# Altium project miniBackplane_SFP.PrjPCB (part 1 of 2)
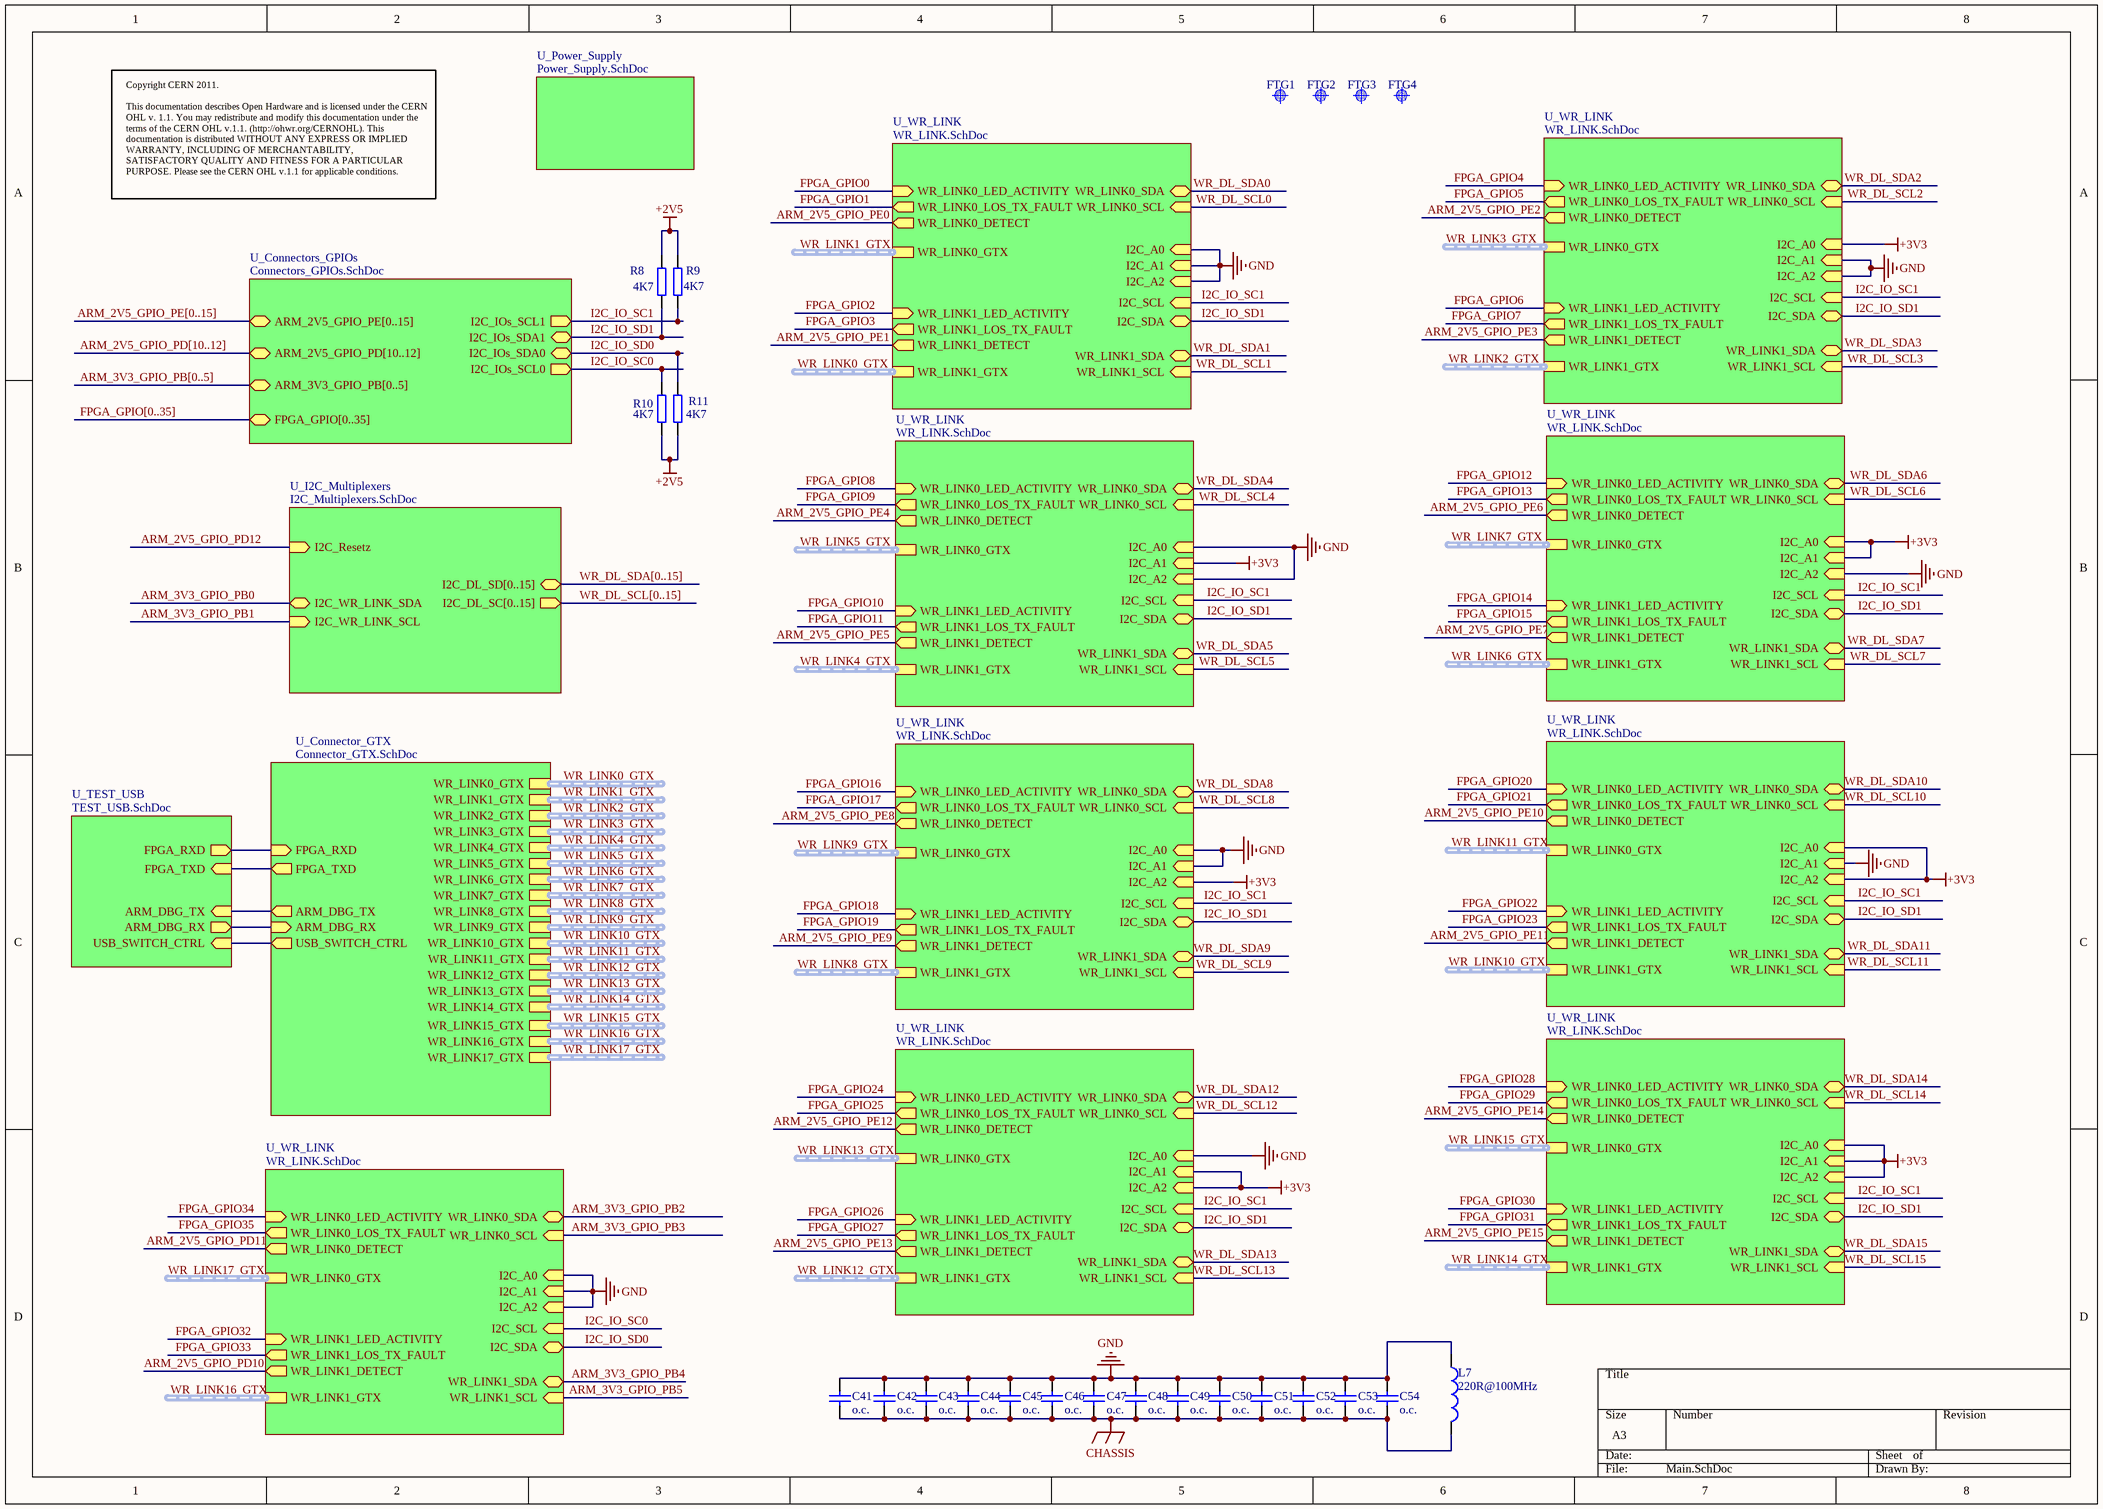
[diagram p0: Main.SchDoc]
7 sheets, 491 parts. Net scope: hierarchical (ports join the sheet entries above them; power ports are global).
Board file: miniBackplane.PcbDoc
Sheets:
  Main.SchDoc
    U_Connector_GTX = Connector_GTX.SchDoc
    U_I2C_Multiplexers = I2C_Multiplexers.SchDoc
    U_Power_Supply = Power_Supply.SchDoc
    U_TEST_USB = TEST_USB.SchDoc
    U_Connectors_GPIOs = Connectors_GPIOs.SchDoc
    U_WR_LINK = WR_LINK.SchDoc
    U_WR_LINK = WR_LINK.SchDoc
    U_WR_LINK = WR_LINK.SchDoc
    U_WR_LINK = WR_LINK.SchDoc
    U_WR_LINK = WR_LINK.SchDoc
    U_WR_LINK = WR_LINK.SchDoc
    U_WR_LINK = WR_LINK.SchDoc
    U_WR_LINK = WR_LINK.SchDoc
    U_WR_LINK = WR_LINK.SchDoc

## Sheet Main.SchDoc
size A3

### Parts
C41  o.c.  [CC1608-0603]
C42  o.c.  [CC1608-0603]
C43  o.c.  [CC1608-0603]
C44  o.c.  [CC1608-0603]
C45  o.c.  [CC1608-0603]
C46  o.c.  [CC1608-0603]
C47  o.c.  [CC1608-0603]
C48  o.c.  [CC1608-0603]
C49  o.c.  [CC1608-0603]
C50  o.c.  [CC1608-0603]
C51  o.c.  [CC1608-0603]
C52  o.c.  [CC1608-0603]
C53  o.c.  [CC1608-0603]
C54  o.c.  [CC1608-0603]
FTG1  Use only in PCB  [FIDUCIAL_TOP_S100-200]  (value not drawn)
FTG2  Use only in PCB  [FIDUCIAL_TOP_S100-200]  (value not drawn)
FTG3  Use only in PCB  [FIDUCIAL_TOP_S100-200]  (value not drawn)
FTG4  Use only in PCB  [FIDUCIAL_TOP_S100-200]  (value not drawn)
L7  Impedance: 220R@100MHz  [0603]  (hidden comment: 220R@100MHz Ferrite Bead)
R8  4K7  [0603]
R9  4K7  [0603]
R10  4K7  [0603]
R11  4K7  [0603]

### Sub-sheets
U_Connector_GTX = Connector_GTX.SchDoc: WR_LINK0_GTX (harness WR_LINK_GTX), WR_LINK1_GTX (harness WR_LINK_GTX), WR_LINK2_GTX (harness WR_LINK_GTX), WR_LINK3_GTX (harness WR_LINK_GTX), WR_LINK4_GTX (harness WR_LINK_GTX), WR_LINK5_GTX (harness WR_LINK_GTX), WR_LINK6_GTX (harness WR_LINK_GTX), WR_LINK7_GTX (harness WR_LINK_GTX), WR_LINK8_GTX (harness WR_LINK_GTX), WR_LINK9_GTX (harness WR_LINK_GTX), WR_LINK10_GTX (harness WR_LINK_GTX), WR_LINK11_GTX (harness WR_LINK_GTX), WR_LINK17_GTX (harness WR_LINK_GTX), WR_LINK16_GTX (harness WR_LINK_GTX), WR_LINK15_GTX (harness WR_LINK_GTX), WR_LINK14_GTX (harness WR_LINK_GTX), WR_LINK13_GTX (harness WR_LINK_GTX), WR_LINK12_GTX (harness WR_LINK_GTX), FPGA_RXD (in), FPGA_TXD (out), ARM_DBG_TX (out), ARM_DBG_RX (in), USB_SWITCH_CTRL (out)
U_Connectors_GPIOs = Connectors_GPIOs.SchDoc: ARM_2V5_GPIO_PE[0..15] (bidir), FPGA_GPIO[0..35] (bidir), ARM_2V5_GPIO_PD[10..12] (bidir), ARM_3V3_GPIO_PB[0..5] (bidir), I2C_IOs_SCL1 (out), I2C_IOs_SDA1 (bidir), I2C_IOs_SCL0 (out), I2C_IOs_SDA0 (bidir)
U_I2C_Multiplexers = I2C_Multiplexers.SchDoc: I2C_DL_SD[0..15] (bidir), I2C_DL_SC[0..15] (out), I2C_Resetz (in), I2C_WR_LINK_SDA (bidir), I2C_WR_LINK_SCL (in)
U_Power_Supply = Power_Supply.SchDoc: no entries
U_TEST_USB = TEST_USB.SchDoc: FPGA_RXD (out), FPGA_TXD (in), ARM_DBG_TX (in), ARM_DBG_RX (out), USB_SWITCH_CTRL (in)
U_WR_LINK = WR_LINK.SchDoc: WR_LINK0_GTX (harness WR_LINK_GTX), I2C_A0 (in), I2C_A1 (in), I2C_A2 (in), I2C_SDA (bidir), I2C_SCL (in), WR_LINK0_SDA (bidir), WR_LINK0_SCL (in), WR_LINK0_DETECT (out), WR_LINK0_LOS_TX_FAULT (out), WR_LINK0_LED_ACTIVITY (in), WR_LINK1_LED_ACTIVITY (in), WR_LINK1_GTX (harness WR_LINK_GTX), WR_LINK1_SDA (bidir), WR_LINK1_SCL (in), WR_LINK1_DETECT (out), WR_LINK1_LOS_TX_FAULT (out)
U_WR_LINK = WR_LINK.SchDoc: WR_LINK0_GTX (harness WR_LINK_GTX), I2C_A0 (in), I2C_A1 (in), I2C_A2 (in), I2C_SDA (bidir), I2C_SCL (in), WR_LINK0_SDA (bidir), WR_LINK0_SCL (in), WR_LINK0_DETECT (out), WR_LINK0_LOS_TX_FAULT (out), WR_LINK0_LED_ACTIVITY (in), WR_LINK1_LED_ACTIVITY (in), WR_LINK1_GTX (harness WR_LINK_GTX), WR_LINK1_SDA (bidir), WR_LINK1_SCL (in), WR_LINK1_DETECT (out), WR_LINK1_LOS_TX_FAULT (out)
U_WR_LINK = WR_LINK.SchDoc: WR_LINK0_GTX (harness WR_LINK_GTX), I2C_A0 (in), I2C_A1 (in), I2C_A2 (in), I2C_SDA (bidir), I2C_SCL (in), WR_LINK0_SDA (bidir), WR_LINK0_SCL (in), WR_LINK0_DETECT (out), WR_LINK0_LOS_TX_FAULT (out), WR_LINK0_LED_ACTIVITY (in), WR_LINK1_LED_ACTIVITY (in), WR_LINK1_GTX (harness WR_LINK_GTX), WR_LINK1_SDA (bidir), WR_LINK1_SCL (in), WR_LINK1_DETECT (out), WR_LINK1_LOS_TX_FAULT (out)
U_WR_LINK = WR_LINK.SchDoc: WR_LINK0_GTX (harness WR_LINK_GTX), I2C_A0 (in), I2C_A1 (in), I2C_A2 (in), I2C_SDA (bidir), I2C_SCL (in), WR_LINK0_SDA (bidir), WR_LINK0_SCL (in), WR_LINK0_DETECT (out), WR_LINK0_LOS_TX_FAULT (out), WR_LINK0_LED_ACTIVITY (in), WR_LINK1_LED_ACTIVITY (in), WR_LINK1_GTX (harness WR_LINK_GTX), WR_LINK1_SDA (bidir), WR_LINK1_SCL (in), WR_LINK1_DETECT (out), WR_LINK1_LOS_TX_FAULT (out)
U_WR_LINK = WR_LINK.SchDoc: WR_LINK0_GTX (harness WR_LINK_GTX), I2C_A0 (in), I2C_A1 (in), I2C_A2 (in), I2C_SDA (bidir), I2C_SCL (in), WR_LINK0_SDA (bidir), WR_LINK0_SCL (in), WR_LINK0_DETECT (out), WR_LINK0_LOS_TX_FAULT (out), WR_LINK0_LED_ACTIVITY (in), WR_LINK1_LED_ACTIVITY (in), WR_LINK1_GTX (harness WR_LINK_GTX), WR_LINK1_SDA (bidir), WR_LINK1_SCL (in), WR_LINK1_DETECT (out), WR_LINK1_LOS_TX_FAULT (out)
U_WR_LINK = WR_LINK.SchDoc: WR_LINK0_GTX (harness WR_LINK_GTX), I2C_A0 (in), I2C_A1 (in), I2C_A2 (in), I2C_SDA (bidir), I2C_SCL (in), WR_LINK0_SDA (bidir), WR_LINK0_SCL (in), WR_LINK0_DETECT (out), WR_LINK0_LOS_TX_FAULT (out), WR_LINK0_LED_ACTIVITY (in), WR_LINK1_LED_ACTIVITY (in), WR_LINK1_GTX (harness WR_LINK_GTX), WR_LINK1_SDA (bidir), WR_LINK1_SCL (in), WR_LINK1_DETECT (out), WR_LINK1_LOS_TX_FAULT (out)
U_WR_LINK = WR_LINK.SchDoc: WR_LINK0_GTX (harness WR_LINK_GTX), I2C_A0 (in), I2C_A1 (in), I2C_A2 (in), I2C_SDA (bidir), I2C_SCL (in), WR_LINK0_SDA (bidir), WR_LINK0_SCL (in), WR_LINK0_DETECT (out), WR_LINK0_LOS_TX_FAULT (out), WR_LINK0_LED_ACTIVITY (in), WR_LINK1_LED_ACTIVITY (in), WR_LINK1_GTX (harness WR_LINK_GTX), WR_LINK1_SDA (bidir), WR_LINK1_SCL (in), WR_LINK1_DETECT (out), WR_LINK1_LOS_TX_FAULT (out)
U_WR_LINK = WR_LINK.SchDoc: WR_LINK0_GTX (harness WR_LINK_GTX), I2C_A0 (in), I2C_A1 (in), I2C_A2 (in), I2C_SDA (bidir), I2C_SCL (in), WR_LINK0_SDA (bidir), WR_LINK0_SCL (in), WR_LINK0_DETECT (out), WR_LINK0_LOS_TX_FAULT (out), WR_LINK0_LED_ACTIVITY (in), WR_LINK1_LED_ACTIVITY (in), WR_LINK1_GTX (harness WR_LINK_GTX), WR_LINK1_SDA (bidir), WR_LINK1_SCL (in), WR_LINK1_DETECT (out), WR_LINK1_LOS_TX_FAULT (out)
U_WR_LINK = WR_LINK.SchDoc: WR_LINK0_GTX (harness WR_LINK_GTX), I2C_A0 (in), I2C_A1 (in), I2C_A2 (in), I2C_SDA (bidir), I2C_SCL (in), WR_LINK0_SDA (bidir), WR_LINK0_SCL (in), WR_LINK0_DETECT (out), WR_LINK0_LOS_TX_FAULT (out), WR_LINK0_LED_ACTIVITY (in), WR_LINK1_LED_ACTIVITY (in), WR_LINK1_GTX (harness WR_LINK_GTX), WR_LINK1_SDA (bidir), WR_LINK1_SCL (in), WR_LINK1_DETECT (out), WR_LINK1_LOS_TX_FAULT (out)

### Nets
+2V5: R8.2 R9.1 R10.2 R11.1
+3V3: sheet U_WR_LINK/I2C_A0, sheet U_WR_LINK/I2C_A1, sheet U_WR_LINK/I2C_A0, sheet U_WR_LINK/I2C_A1, sheet U_WR_LINK/I2C_A2, sheet U_WR_LINK/I2C_A0, sheet U_WR_LINK/I2C_A2, sheet U_WR_LINK/I2C_A1, sheet U_WR_LINK/I2C_A2, sheet U_WR_LINK/I2C_A0, sheet U_WR_LINK/I2C_A1, sheet U_WR_LINK/I2C_A2
CHASSIS: C41.1 C42.1 C43.1 C44.1 C45.1 C46.1 C47.1 C48.1 C49.1 C50.1 C51.1 C52.1 C53.1 C54.1 L7.2
GND: C41.2 C42.2 C43.2 C44.2 C45.2 C46.2 C47.2 C48.2 C49.2 C50.2 C51.2 C52.2 C53.2 C54.2 L7.1 ; sheet U_WR_LINK/I2C_A0, sheet U_WR_LINK/I2C_A1, sheet U_WR_LINK/I2C_A2, sheet U_WR_LINK/I2C_A1, sheet U_WR_LINK/I2C_A2, sheet U_WR_LINK/I2C_A0, sheet U_WR_LINK/I2C_A2, sheet U_WR_LINK/I2C_A2, sheet U_WR_LINK/I2C_A0, sheet U_WR_LINK/I2C_A1, sheet U_WR_LINK/I2C_A1, sheet U_WR_LINK/I2C_A0, sheet U_WR_LINK/I2C_A0, sheet U_WR_LINK/I2C_A1, sheet U_WR_LINK/I2C_A2
FPGA_RXD: sheet U_Connector_GTX/FPGA_RXD, sheet U_TEST_USB/FPGA_RXD
FPGA_TXD: sheet U_Connector_GTX/FPGA_TXD, sheet U_TEST_USB/FPGA_TXD
I2C_IO_SC0: R10.1 ; sheet U_Connectors_GPIOs/I2C_IOs_SCL0, sheet U_WR_LINK/I2C_SCL  [project net FPGA-GPIO37]
I2C_IO_SC1: R9.2 ; sheet U_Connectors_GPIOs/I2C_IOs_SCL1, sheet U_WR_LINK/I2C_SCL, sheet U_WR_LINK/I2C_SCL, sheet U_WR_LINK/I2C_SCL, sheet U_WR_LINK/I2C_SCL, sheet U_WR_LINK/I2C_SCL, sheet U_WR_LINK/I2C_SCL, sheet U_WR_LINK/I2C_SCL, sheet U_WR_LINK/I2C_SCL  [project net FPGA-GPIO39]
I2C_IO_SD0: R11.2 ; sheet U_Connectors_GPIOs/I2C_IOs_SDA0, sheet U_WR_LINK/I2C_SDA  [project net FPGA-GPIO36]
I2C_IO_SD1: R8.1 ; sheet U_Connectors_GPIOs/I2C_IOs_SDA1, sheet U_WR_LINK/I2C_SDA, sheet U_WR_LINK/I2C_SDA, sheet U_WR_LINK/I2C_SDA, sheet U_WR_LINK/I2C_SDA, sheet U_WR_LINK/I2C_SDA, sheet U_WR_LINK/I2C_SDA, sheet U_WR_LINK/I2C_SDA, sheet U_WR_LINK/I2C_SDA  [project net FPGA-GPIO38]
NetIC8_4: sheet U_Connector_GTX/USB_SWITCH_CTRL, sheet U_TEST_USB/USB_SWITCH_CTRL
NetIC8_5: sheet U_Connector_GTX/ARM_DBG_RX, sheet U_TEST_USB/ARM_DBG_RX
NetIC8_7: sheet U_Connector_GTX/ARM_DBG_TX, sheet U_TEST_USB/ARM_DBG_TX

### Buses and harness runs
bus ARM_2V5_GPIO_PD[10..12] = sheet U_Connectors_GPIOs/ARM_2V5_GPIO_PD[10..12]
bus ARM_2V5_GPIO_PE[0..15] = sheet U_Connectors_GPIOs/ARM_2V5_GPIO_PE[0..15]
bus ARM_3V3_GPIO_PB[0..5] = sheet U_Connectors_GPIOs/ARM_3V3_GPIO_PB[0..5]
bus FPGA_GPIO[0..35] = sheet U_Connectors_GPIOs/FPGA_GPIO[0..35]
bus WR_DL_SCL[0..15] = sheet U_I2C_Multiplexers/I2C_DL_SC[0..15]
bus WR_DL_SDA[0..15] = sheet U_I2C_Multiplexers/I2C_DL_SD[0..15]
harness WR_LINK0_GTX = sheet U_Connector_GTX/WR_LINK0_GTX
harness WR_LINK0_GTX = sheet U_WR_LINK/WR_LINK1_GTX
harness WR_LINK1_GTX = sheet U_Connector_GTX/WR_LINK1_GTX
harness WR_LINK1_GTX = sheet U_WR_LINK/WR_LINK0_GTX
harness WR_LINK2_GTX = sheet U_Connector_GTX/WR_LINK2_GTX
harness WR_LINK2_GTX = sheet U_WR_LINK/WR_LINK1_GTX
harness WR_LINK3_GTX = sheet U_Connector_GTX/WR_LINK3_GTX
harness WR_LINK3_GTX = sheet U_WR_LINK/WR_LINK0_GTX
harness WR_LINK4_GTX = sheet U_Connector_GTX/WR_LINK4_GTX
harness WR_LINK4_GTX = sheet U_WR_LINK/WR_LINK1_GTX
harness WR_LINK5_GTX = sheet U_Connector_GTX/WR_LINK5_GTX
harness WR_LINK5_GTX = sheet U_WR_LINK/WR_LINK0_GTX
harness WR_LINK6_GTX = sheet U_Connector_GTX/WR_LINK6_GTX
harness WR_LINK6_GTX = sheet U_WR_LINK/WR_LINK1_GTX
harness WR_LINK7_GTX = sheet U_Connector_GTX/WR_LINK7_GTX
harness WR_LINK7_GTX = sheet U_WR_LINK/WR_LINK0_GTX
harness WR_LINK8_GTX = sheet U_Connector_GTX/WR_LINK8_GTX
harness WR_LINK8_GTX = sheet U_WR_LINK/WR_LINK1_GTX
harness WR_LINK9_GTX = sheet U_Connector_GTX/WR_LINK9_GTX
harness WR_LINK9_GTX = sheet U_WR_LINK/WR_LINK0_GTX
harness WR_LINK10_GTX = sheet U_Connector_GTX/WR_LINK10_GTX
harness WR_LINK10_GTX = sheet U_WR_LINK/WR_LINK1_GTX
harness WR_LINK11_GTX = sheet U_Connector_GTX/WR_LINK11_GTX
harness WR_LINK11_GTX = sheet U_WR_LINK/WR_LINK0_GTX
harness WR_LINK12_GTX = sheet U_Connector_GTX/WR_LINK12_GTX
harness WR_LINK12_GTX = sheet U_WR_LINK/WR_LINK1_GTX
harness WR_LINK13_GTX = sheet U_Connector_GTX/WR_LINK13_GTX
harness WR_LINK13_GTX = sheet U_WR_LINK/WR_LINK0_GTX
harness WR_LINK14_GTX = sheet U_Connector_GTX/WR_LINK14_GTX
harness WR_LINK14_GTX = sheet U_WR_LINK/WR_LINK1_GTX
harness WR_LINK15_GTX = sheet U_Connector_GTX/WR_LINK15_GTX
harness WR_LINK15_GTX = sheet U_WR_LINK/WR_LINK0_GTX
harness WR_LINK16_GTX = sheet U_Connector_GTX/WR_LINK16_GTX
harness WR_LINK16_GTX = sheet U_WR_LINK/WR_LINK1_GTX
harness WR_LINK17_GTX = sheet U_Connector_GTX/WR_LINK17_GTX
harness WR_LINK17_GTX = sheet U_WR_LINK/WR_LINK0_GTX

### Notes on the sheet
- Copyright CERN 2011.
  This documentation describes Open Hardware and is licensed under the CERN OHL v. 1.1. You may redistribute and modify this documentation under the terms of the CERN OHL v.1.1. (http://ohwr.org/CERNOHL). This documentation is distributed WITHOUT ANY EXPRESS OR IMPLIED WARRANTY, INCLUDING OF MERCHANTABILITY, SATISFACTORY QUALITY AND FITNESS FOR A PARTICULAR PURPOSE. Please see the CERN OHL v.1.1 for applicable conditions.

### Library data of the parts
C41-C54 = CC0603_O.C.: Capacitor; Manufacturer1: Phycomp; TC: X7R; Tolerance: ±10%; Voltage: 16V; Published: 8-Jun-2000; LatestRevisionDate: 17-Jul-2002; LatestRevisionNote: Re-released for DXP Platform.; PackageReference: RAD-0.3; Publisher: Altium Limited; Manufacturer1 PN: *; Distributor1: Digikey; Distributor1 PN: *; Case: 0603; Value: o.c.
FTG1-FTG4 = Fiducial Target: Part Number: FIDUCIAL_TARGET_S100-200; Part Description: Scare Fiducial Target, Top Layer, 1.0mm, Top Sloder 2.0mm, Keepout =2.0mm; Mounted: No; Table: Pads; Component Kind: Standard (No BOM); Component Type: Standard (No BOM); Pin Count: 1; Family: Fiducial; Socket: No; SMD: Yes; Status: None; ComponentHeight: 0mm; Author: CERN DEM JLC; CreateDate: 2/9/2010; LatestRevisionDate: 2/9/2010; PackageDescription: Scare Fiducial Target, Top Layer, 1.0mm, Top Sloder 2.0mm, Keepout =2.0mm
L7 = L_FERRITE_BEAD: ferrite bead; Manufacturer1: Murata; Manufacturer1 PN: BLM18KG221SN1D; Current Rating: 2.2A; DCR: 50mOhm; Case: 0603; Distributor1: Digikey; Distributor1 PN: 490-5255-1-ND
R8-R11 = R0603_4.7K_±1%_0.1W_100PPM: SMD Resistor; Manufacturer1: Panasonic; Manufacturer1 PN: ERJ-3EKF4701V; TCR: 100ppm; Power Rating: 0.1W; Tolerance: ±1%; Case: 0603; Distributor1: DigiKey; Distributor1 PN: P4.70KHCT-ND; Value: 4K7

## Sheet Connector_GTX.SchDoc
size A3
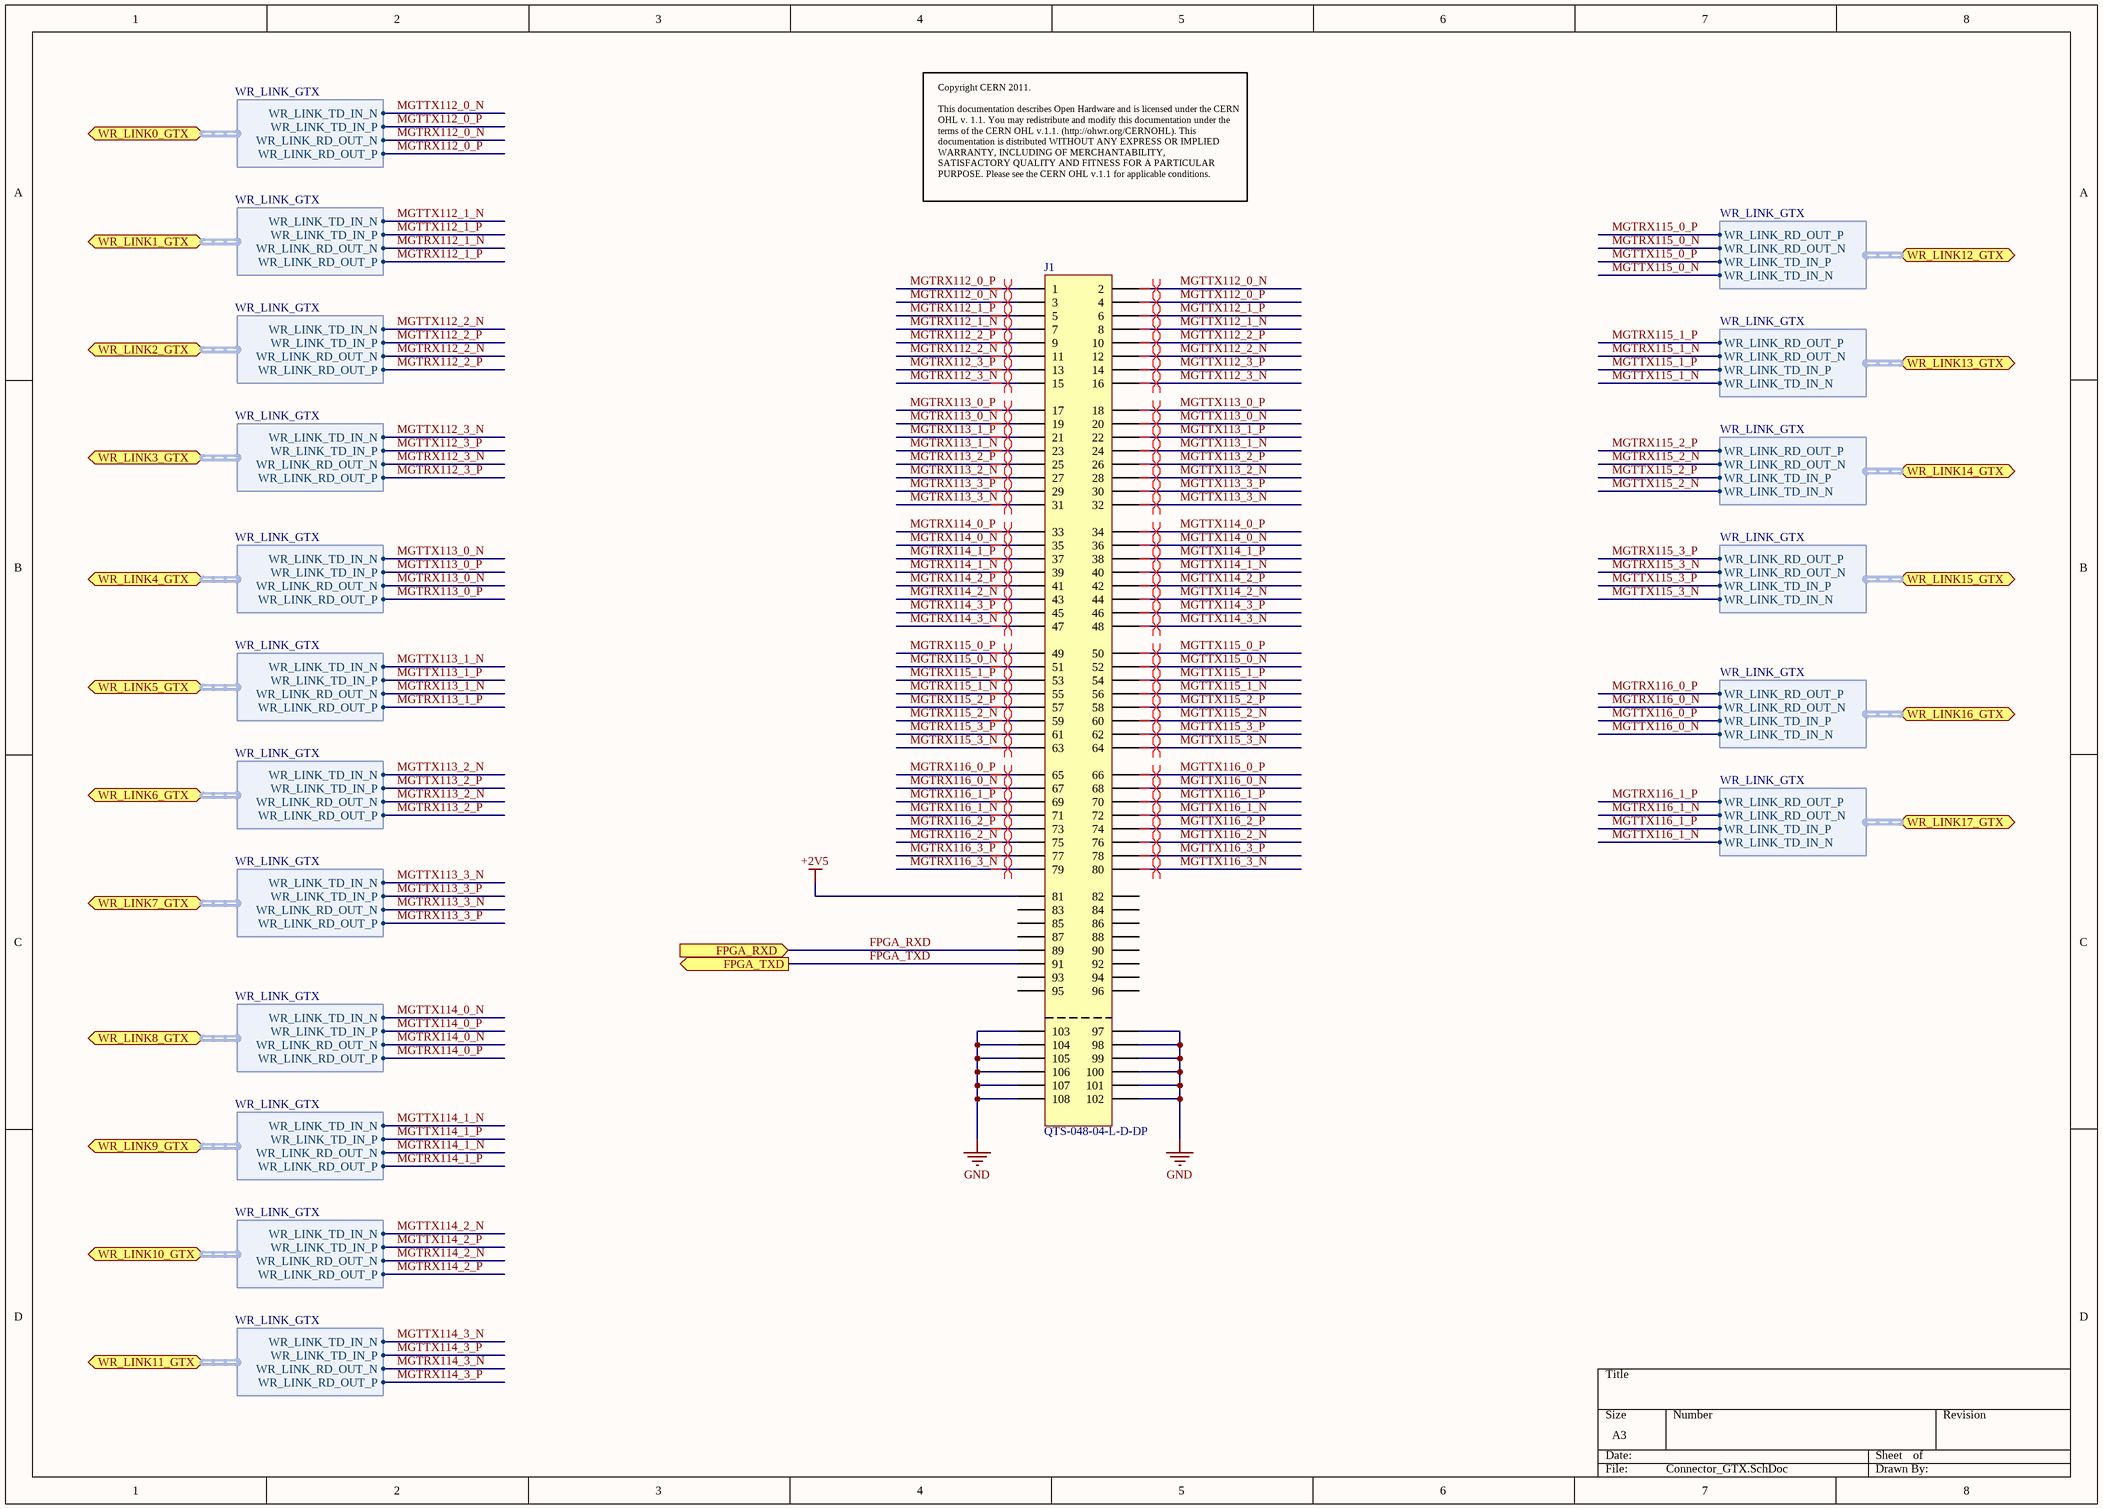
[diagram p1: Connector_GTX.SchDoc]

### Parts
J1  QTS-048-04-L-D-DP  [QTS-048-XX-X-D-DP-A]

### Ports
FPGA_RXD (in), FPGA_TXD (out), WR_LINK0_GTX (harness WR_LINK_GTX), WR_LINK1_GTX (harness WR_LINK_GTX), WR_LINK2_GTX (harness WR_LINK_GTX), WR_LINK3_GTX (harness WR_LINK_GTX), WR_LINK4_GTX (harness WR_LINK_GTX), WR_LINK5_GTX (harness WR_LINK_GTX), WR_LINK6_GTX (harness WR_LINK_GTX), WR_LINK7_GTX (harness WR_LINK_GTX), WR_LINK8_GTX (harness WR_LINK_GTX), WR_LINK9_GTX (harness WR_LINK_GTX), WR_LINK10_GTX (harness WR_LINK_GTX), WR_LINK11_GTX (harness WR_LINK_GTX), WR_LINK12_GTX (harness WR_LINK_GTX), WR_LINK13_GTX (harness WR_LINK_GTX), WR_LINK14_GTX (harness WR_LINK_GTX), WR_LINK15_GTX (harness WR_LINK_GTX), WR_LINK16_GTX (harness WR_LINK_GTX), WR_LINK17_GTX (harness WR_LINK_GTX)

### Harnesses
WR_LINK_GTX: WR_LINK_TD_IN_N, WR_LINK_TD_IN_P, WR_LINK_RD_OUT_N, WR_LINK_RD_OUT_P

### Nets
+2V5: J1.81
GND: J1.97 J1.98 J1.99 J1.100 J1.101 J1.102 J1.103 J1.104 J1.105 J1.106 J1.107 J1.108
FPGA_RXD: J1.89 ; port FPGA_RXD
FPGA_TXD: J1.91 ; port FPGA_TXD
MGTRX112_0_N: J1.3 ; port WR_LINK0_GTX.WR_LINK_RD_OUT_N
MGTRX112_0_P: J1.1 ; port WR_LINK0_GTX.WR_LINK_RD_OUT_P
MGTRX112_1_N: J1.7 ; port WR_LINK1_GTX.WR_LINK_RD_OUT_N
MGTRX112_1_P: J1.5 ; port WR_LINK1_GTX.WR_LINK_RD_OUT_P
MGTRX112_2_N: J1.11 ; port WR_LINK2_GTX.WR_LINK_RD_OUT_N
MGTRX112_2_P: J1.9 ; port WR_LINK2_GTX.WR_LINK_RD_OUT_P
MGTRX112_3_N: J1.15 ; port WR_LINK3_GTX.WR_LINK_RD_OUT_N
MGTRX112_3_P: J1.13 ; port WR_LINK3_GTX.WR_LINK_RD_OUT_P
MGTRX113_0_N: J1.19 ; port WR_LINK4_GTX.WR_LINK_RD_OUT_N
MGTRX113_0_P: J1.17 ; port WR_LINK4_GTX.WR_LINK_RD_OUT_P
MGTRX113_1_N: J1.23 ; port WR_LINK5_GTX.WR_LINK_RD_OUT_N
MGTRX113_1_P: J1.21 ; port WR_LINK5_GTX.WR_LINK_RD_OUT_P
MGTRX113_2_N: J1.27 ; port WR_LINK6_GTX.WR_LINK_RD_OUT_N
MGTRX113_2_P: J1.25 ; port WR_LINK6_GTX.WR_LINK_RD_OUT_P
MGTRX113_3_N: J1.31 ; port WR_LINK7_GTX.WR_LINK_RD_OUT_N
MGTRX113_3_P: J1.29 ; port WR_LINK7_GTX.WR_LINK_RD_OUT_P
MGTRX114_0_N: J1.35 ; port WR_LINK8_GTX.WR_LINK_RD_OUT_N
MGTRX114_0_P: J1.33 ; port WR_LINK8_GTX.WR_LINK_RD_OUT_P
MGTRX114_1_N: J1.39 ; port WR_LINK9_GTX.WR_LINK_RD_OUT_N
MGTRX114_1_P: J1.37 ; port WR_LINK9_GTX.WR_LINK_RD_OUT_P
MGTRX114_2_N: J1.43 ; port WR_LINK10_GTX.WR_LINK_RD_OUT_N
MGTRX114_2_P: J1.41 ; port WR_LINK10_GTX.WR_LINK_RD_OUT_P
MGTRX114_3_N: J1.47 ; port WR_LINK11_GTX.WR_LINK_RD_OUT_N
MGTRX114_3_P: J1.45 ; port WR_LINK11_GTX.WR_LINK_RD_OUT_P
MGTRX115_0_N: J1.51 ; port WR_LINK12_GTX.WR_LINK_RD_OUT_N
MGTRX115_0_P: J1.49 ; port WR_LINK12_GTX.WR_LINK_RD_OUT_P
MGTRX115_1_N: J1.55 ; port WR_LINK13_GTX.WR_LINK_RD_OUT_N
MGTRX115_1_P: J1.53 ; port WR_LINK13_GTX.WR_LINK_RD_OUT_P
MGTRX115_2_N: J1.59 ; port WR_LINK14_GTX.WR_LINK_RD_OUT_N
MGTRX115_2_P: J1.57 ; port WR_LINK14_GTX.WR_LINK_RD_OUT_P
MGTRX115_3_N: J1.63 ; port WR_LINK15_GTX.WR_LINK_RD_OUT_N
MGTRX115_3_P: J1.61 ; port WR_LINK15_GTX.WR_LINK_RD_OUT_P
MGTRX116_0_N: J1.67 ; port WR_LINK16_GTX.WR_LINK_RD_OUT_N
MGTRX116_0_P: J1.65 ; port WR_LINK16_GTX.WR_LINK_RD_OUT_P
MGTRX116_1_N: J1.71 ; port WR_LINK17_GTX.WR_LINK_RD_OUT_N
MGTRX116_1_P: J1.69 ; port WR_LINK17_GTX.WR_LINK_RD_OUT_P
MGTRX116_2_N: J1.75
MGTRX116_2_P: J1.73
MGTRX116_3_N: J1.79
MGTRX116_3_P: J1.77
MGTTX112_0_N: J1.2 ; port WR_LINK0_GTX.WR_LINK_TD_IN_N
MGTTX112_0_P: J1.4 ; port WR_LINK0_GTX.WR_LINK_TD_IN_P
MGTTX112_1_N: J1.8 ; port WR_LINK1_GTX.WR_LINK_TD_IN_N
MGTTX112_1_P: J1.6 ; port WR_LINK1_GTX.WR_LINK_TD_IN_P
MGTTX112_2_N: J1.12 ; port WR_LINK2_GTX.WR_LINK_TD_IN_N
MGTTX112_2_P: J1.10 ; port WR_LINK2_GTX.WR_LINK_TD_IN_P
MGTTX112_3_N: J1.16 ; port WR_LINK3_GTX.WR_LINK_TD_IN_N
MGTTX112_3_P: J1.14 ; port WR_LINK3_GTX.WR_LINK_TD_IN_P
MGTTX113_0_N: J1.20 ; port WR_LINK4_GTX.WR_LINK_TD_IN_N
MGTTX113_0_P: J1.18 ; port WR_LINK4_GTX.WR_LINK_TD_IN_P
MGTTX113_1_N: J1.24 ; port WR_LINK5_GTX.WR_LINK_TD_IN_N
MGTTX113_1_P: J1.22 ; port WR_LINK5_GTX.WR_LINK_TD_IN_P
MGTTX113_2_N: J1.28 ; port WR_LINK6_GTX.WR_LINK_TD_IN_N
MGTTX113_2_P: J1.26 ; port WR_LINK6_GTX.WR_LINK_TD_IN_P
MGTTX113_3_N: J1.32 ; port WR_LINK7_GTX.WR_LINK_TD_IN_N
MGTTX113_3_P: J1.30 ; port WR_LINK7_GTX.WR_LINK_TD_IN_P
MGTTX114_0_N: J1.36 ; port WR_LINK8_GTX.WR_LINK_TD_IN_N
MGTTX114_0_P: J1.34 ; port WR_LINK8_GTX.WR_LINK_TD_IN_P
MGTTX114_1_N: J1.40 ; port WR_LINK9_GTX.WR_LINK_TD_IN_N
MGTTX114_1_P: J1.38 ; port WR_LINK9_GTX.WR_LINK_TD_IN_P
MGTTX114_2_N: J1.44 ; port WR_LINK10_GTX.WR_LINK_TD_IN_N
MGTTX114_2_P: J1.42 ; port WR_LINK10_GTX.WR_LINK_TD_IN_P
MGTTX114_3_N: J1.48 ; port WR_LINK11_GTX.WR_LINK_TD_IN_N
MGTTX114_3_P: J1.46 ; port WR_LINK11_GTX.WR_LINK_TD_IN_P
MGTTX115_0_N: J1.52 ; port WR_LINK12_GTX.WR_LINK_TD_IN_N
MGTTX115_0_P: J1.50 ; port WR_LINK12_GTX.WR_LINK_TD_IN_P
MGTTX115_1_N: J1.56 ; port WR_LINK13_GTX.WR_LINK_TD_IN_N
MGTTX115_1_P: J1.54 ; port WR_LINK13_GTX.WR_LINK_TD_IN_P
MGTTX115_2_N: J1.60 ; port WR_LINK14_GTX.WR_LINK_TD_IN_N
MGTTX115_2_P: J1.58 ; port WR_LINK14_GTX.WR_LINK_TD_IN_P
MGTTX115_3_N: J1.64 ; port WR_LINK15_GTX.WR_LINK_TD_IN_N
MGTTX115_3_P: J1.62 ; port WR_LINK15_GTX.WR_LINK_TD_IN_P
MGTTX116_0_N: J1.68 ; port WR_LINK16_GTX.WR_LINK_TD_IN_N
MGTTX116_0_P: J1.66 ; port WR_LINK16_GTX.WR_LINK_TD_IN_P
MGTTX116_1_N: J1.72 ; port WR_LINK17_GTX.WR_LINK_TD_IN_N
MGTTX116_1_P: J1.70 ; port WR_LINK17_GTX.WR_LINK_TD_IN_P
MGTTX116_2_N: J1.76
MGTTX116_2_P: J1.74
MGTTX116_3_N: J1.80
MGTTX116_3_P: J1.78

Not connected (* = marked no-connect by the designer): J1 82 83 84 85 86 87 88 90 92 93 94 95 96

### Layout directives
differential pair: MGTRX112_0_N, MGTRX112_0_P, MGTRX112_1_N, MGTRX112_1_P, MGTRX112_2_N, MGTRX112_2_P, MGTRX112_3_N, MGTRX112_3_P, MGTRX113_0_N, MGTRX113_0_P, MGTRX113_1_N, MGTRX113_1_P, MGTRX113_2_N, MGTRX113_2_P, MGTRX113_3_N, MGTRX113_3_P, MGTRX114_0_N, MGTRX114_0_P, MGTRX114_1_N, MGTRX114_1_P, MGTRX114_2_N, MGTRX114_2_P, MGTRX114_3_N, MGTRX114_3_P, MGTRX115_0_N, MGTRX115_0_P, MGTRX115_1_N, MGTRX115_1_P, MGTRX115_2_N, MGTRX115_2_P, MGTRX115_3_N, MGTRX115_3_P, MGTRX116_0_N, MGTRX116_0_P, MGTRX116_1_N, MGTRX116_1_P, MGTRX116_2_N, MGTRX116_2_P, MGTRX116_3_N, MGTRX116_3_P, MGTTX112_0_N, MGTTX112_0_P, MGTTX112_1_N, MGTTX112_1_P, MGTTX112_2_N, MGTTX112_2_P, MGTTX112_3_N, MGTTX112_3_P, MGTTX113_0_N, MGTTX113_0_P, MGTTX113_1_N, MGTTX113_1_P, MGTTX113_2_N, MGTTX113_2_P, MGTTX113_3_N, MGTTX113_3_P, MGTTX114_0_N, MGTTX114_0_P, MGTTX114_1_N, MGTTX114_1_P, MGTTX114_2_N, MGTTX114_2_P, MGTTX114_3_N, MGTTX114_3_P, MGTTX115_0_N, MGTTX115_0_P, MGTTX115_1_N, MGTTX115_1_P, MGTTX115_2_N, MGTTX115_2_P, MGTTX115_3_N, MGTTX115_3_P, MGTTX116_0_N, MGTTX116_0_P, MGTTX116_1_N, MGTTX116_1_P, MGTTX116_2_N, MGTTX116_2_P, MGTTX116_3_N, MGTTX116_3_P

### Notes on the sheet
- Copyright CERN 2011.
  This documentation describes Open Hardware and is licensed under the CERN OHL v. 1.1. You may redistribute and modify this documentation under the terms of the CERN OHL v.1.1. (http://ohwr.org/CERNOHL). This documentation is distributed WITHOUT ANY EXPRESS OR IMPLIED WARRANTY, INCLUDING OF MERCHANTABILITY, SATISFACTORY QUALITY AND FITNESS FOR A PARTICULAR PURPOSE. Please see the CERN OHL v.1.1 for applicable conditions.

### Library data of the parts
J1 = QTS-048-01-L-D-DP: High Speed Ground Plane Header; Manufacturer1: Samtec; Manufacturer1 PN: QTS-048-04-L-D-DP

## Sheet I2C_Multiplexers.SchDoc
size A4 portrait
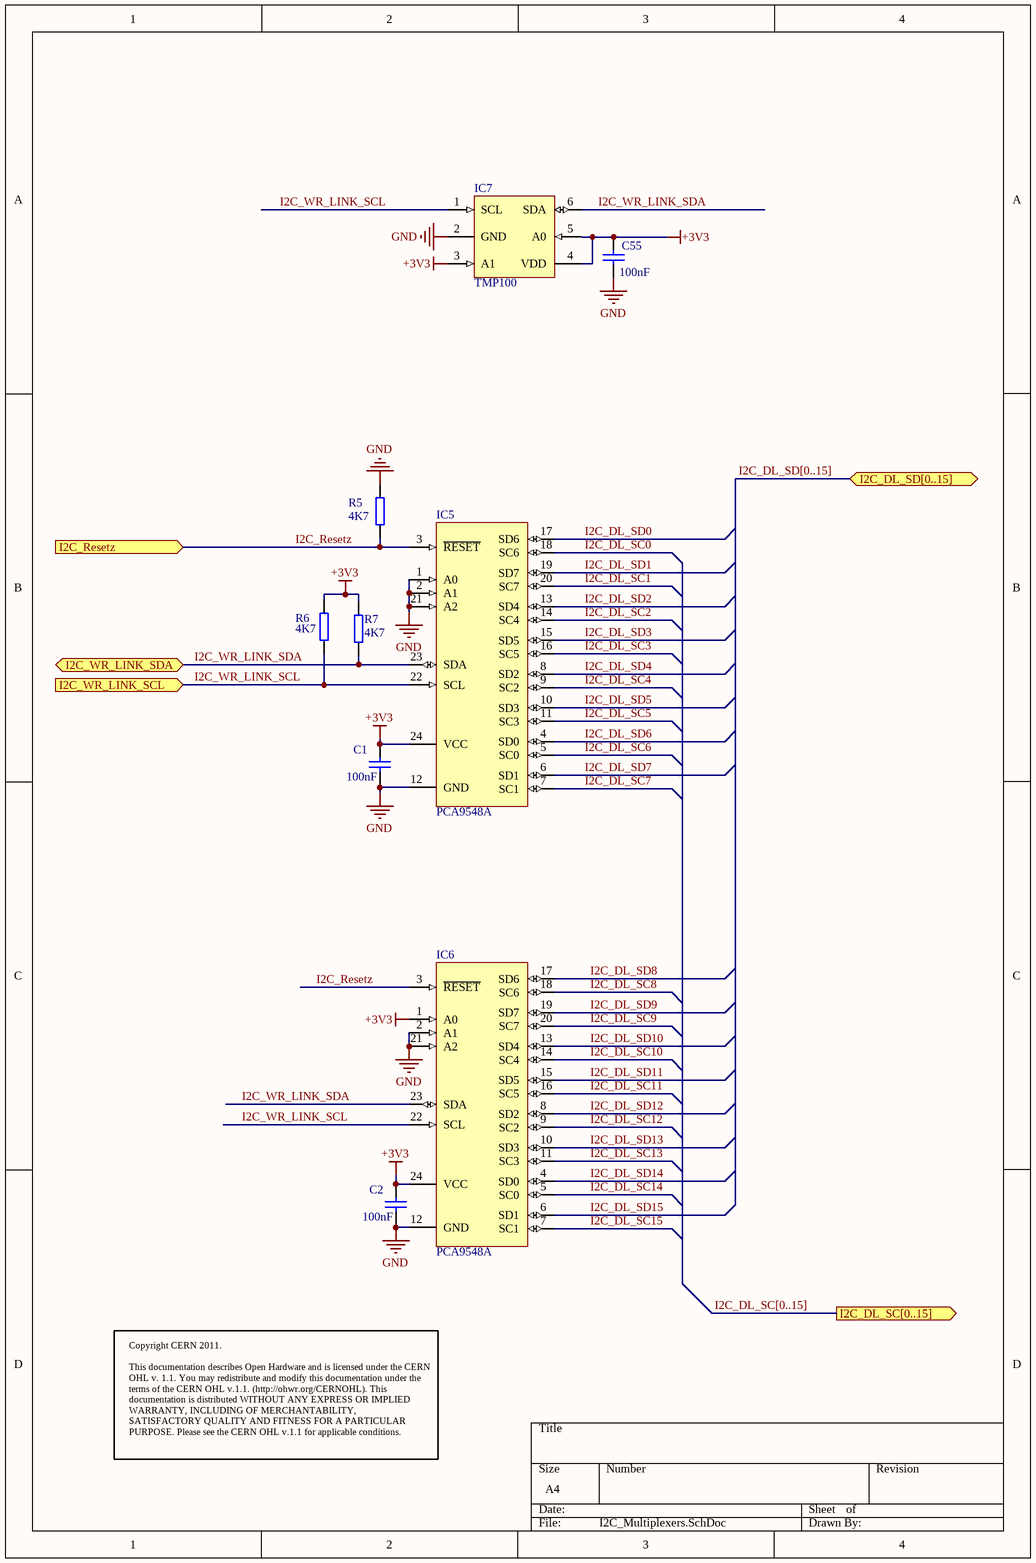
[diagram p2: I2C_Multiplexers.SchDoc]

### Parts
C1  100nF  [CC1608-0603]
C2  100nF  [CC1608-0603]
C55  100nF  [CC1608-0603]
IC5  PCA9548A  [SOP65P640X120-24N]
IC6  PCA9548A  [SOP65P640X120-24N]
IC7  TMP100  [SOT23A-6L]
R5  4K7  [0603]
R6  4K7  [0603]
R7  4K7  [0603]

### Ports
I2C_DL_SC[0..15] (out), I2C_DL_SD[0..15] (bidir), I2C_Resetz (in), I2C_WR_LINK_SCL (in), I2C_WR_LINK_SDA (bidir)

### Nets
+3V3: C1.2 C2.2 C55.2 IC5.24(VCC) IC6.1(A0) IC6.24(VCC) IC7.3(A1) IC7.4(VDD) IC7.5(A0) R6.1 R7.1
GND: C1.1 C2.1 C55.1 IC5.1(A0) IC5.2(A1) IC5.12(GND) IC5.21(A2) IC6.2(A1) IC6.12(GND) IC6.21(A2) IC7.2(GND) R5.2
I2C_DL_SC0: IC5.18(SC6)
I2C_DL_SC1: IC5.20(SC7)
I2C_DL_SC2: IC5.14(SC4)
I2C_DL_SC3: IC5.16(SC5)
I2C_DL_SC4: IC5.9(SC2)
I2C_DL_SC5: IC5.11(SC3)
I2C_DL_SC6: IC5.5(SC0)
I2C_DL_SC7: IC5.7(SC1)
I2C_DL_SC8: IC6.18(SC6)
I2C_DL_SC9: IC6.20(SC7)
I2C_DL_SC10: IC6.14(SC4)
I2C_DL_SC11: IC6.16(SC5)
I2C_DL_SC12: IC6.9(SC2)
I2C_DL_SC13: IC6.11(SC3)
I2C_DL_SC14: IC6.5(SC0)
I2C_DL_SC15: IC6.7(SC1)
I2C_DL_SD0: IC5.17(SD6)
I2C_DL_SD1: IC5.19(SD7)
I2C_DL_SD2: IC5.13(SD4)
I2C_DL_SD3: IC5.15(SD5)
I2C_DL_SD4: IC5.8(SD2)
I2C_DL_SD5: IC5.10(SD3)
I2C_DL_SD6: IC5.4(SD0)
I2C_DL_SD7: IC5.6(SD1)
I2C_DL_SD8: IC6.17(SD6)
I2C_DL_SD9: IC6.19(SD7)
I2C_DL_SD10: IC6.13(SD4)
I2C_DL_SD11: IC6.15(SD5)
I2C_DL_SD12: IC6.8(SD2)
I2C_DL_SD13: IC6.10(SD3)
I2C_DL_SD14: IC6.4(SD0)
I2C_DL_SD15: IC6.6(SD1)
I2C_Resetz: IC5.3(~{RESET}) IC6.3(~{RESET}) R5.1 ; port I2C_Resetz  [project net ARM_2V5_GPIO_PD12]
I2C_WR_LINK_SCL: IC5.22(SCL) IC6.22(SCL) IC7.1(SCL) R6.2 ; port I2C_WR_LINK_SCL  [project net ARM_3V3_GPIO_PB1]
I2C_WR_LINK_SDA: IC5.23(SDA) IC6.23(SDA) IC7.6(SDA) R7.2 ; port I2C_WR_LINK_SDA  [project net ARM_3V3_GPIO_PB0]

### Buses and harness runs
bus I2C_DL_SC[0..15] = port I2C_DL_SC[0..15]
bus I2C_DL_SD[0..15] = port I2C_DL_SD[0..15]

### Notes on the sheet
- Copyright CERN 2011.
  This documentation describes Open Hardware and is licensed under the CERN OHL v. 1.1. You may redistribute and modify this documentation under the terms of the CERN OHL v.1.1. (http://ohwr.org/CERNOHL). This documentation is distributed WITHOUT ANY EXPRESS OR IMPLIED WARRANTY, INCLUDING OF MERCHANTABILITY, SATISFACTORY QUALITY AND FITNESS FOR A PARTICULAR PURPOSE. Please see the CERN OHL v.1.1 for applicable conditions.

### Library data of the parts
C1 C2 C55 = CC0603_100NF_16V_10%_X7R: Capacitor; Manufacturer1: AVX; Manufacturer1 PN: 0603YC104KAT2A; TC: X7R; Tolerance: ±10%; Voltage: 16V; Published: 8-Jun-2000; LatestRevisionDate: 17-Jul-2002; LatestRevisionNote: Re-released for DXP Platform.; PackageReference: RAD-0.3; Publisher: Altium Limited; Distributor1: Digikey; Distributor1 PN: 478-1239-1-ND; Case: 0603; Value: 100nF
IC5 IC6 = PCA9548A: 8-channel 2C-bus switch with reset; Manufacturer1 PN: PCA9548APW,112; Manufacturer1: NXP Semiconductors; Distributor1: Digikey; Distributor1 PN: 568-3384-5-ND
IC7 = TMP100: I2C temp. sensor; RefId: 296-12750-1-ND; Value: TMP101NA/250; Supplier: Digikey
R5-R7 = R0603_4.7K_±1%_0.1W_100PPM: as R8 on sheet Main; Case: 0603; Distributor1: DigiKey; Distributor1 PN: P4.70KHCT-ND; Value: 4K7

## Sheet Power_Supply.SchDoc
size A4
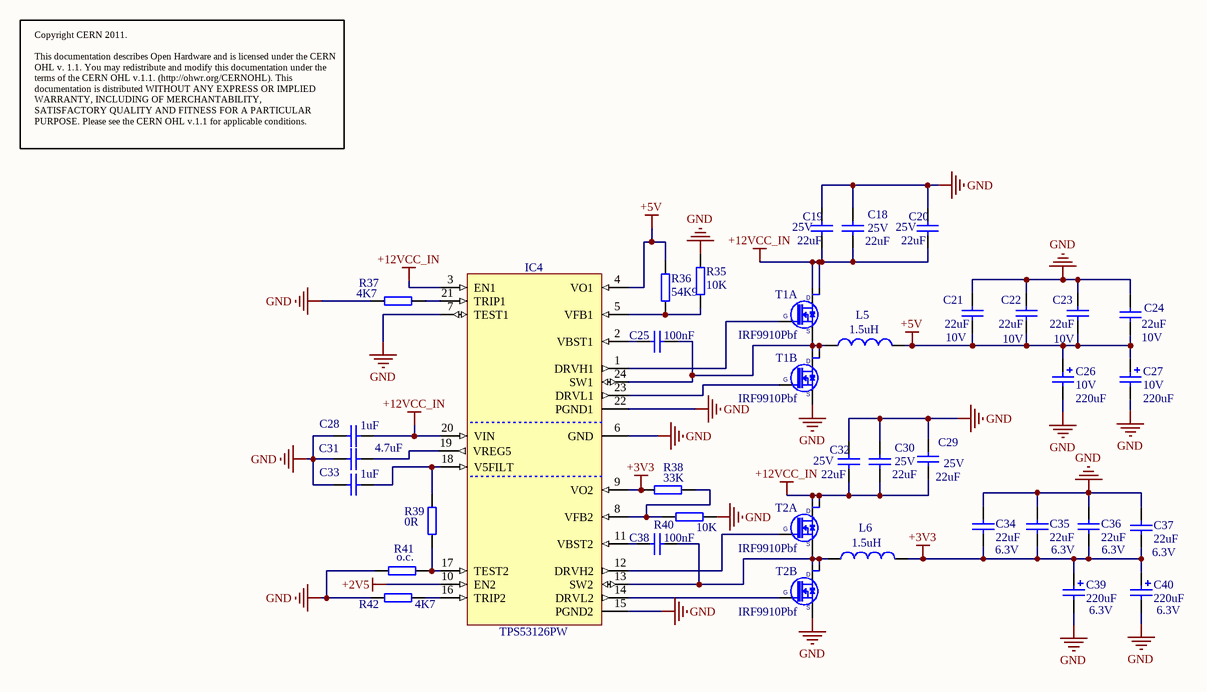
[diagram p3: Power_Supply.SchDoc]

### Parts
C18  value 22uF  Voltage: 25V  [CC3216-1206]  (hidden comment: 22uF 25V)
C19  value 22uF  Voltage: 25V  [CC3216-1206]  (hidden comment: 22uF 25V)
C20  value 22uF  Voltage: 25V  [CC3216-1206]  (hidden comment: 22uF 25V)
C21  value 22uF  Voltage: 10V  [CC2012-0805]  (hidden comment: 22uF 10V)
C22  value 22uF  Voltage: 10V  [CC2012-0805]  (hidden comment: 22uF 10V)
C23  value 22uF  Voltage: 10V  [CC2012-0805]  (hidden comment: 22uF 10V)
C24  value 22uF  Voltage: 10V  [CC2012-0805]  (hidden comment: 22uF 10V)
C25  100nF  [CC1608-0603]
C26  value 220uF  Voltage: 10V  [D]  (hidden comment: 220uF 10V)
C27  value 220uF  Voltage: 10V  [D]  (hidden comment: 220uF 10V)
C28  1uF  [CC1608-0603]
C29  value 22uF  Voltage: 25V  [CC3216-1206]  (hidden comment: 22uF 25V)
C30  value 22uF  Voltage: 25V  [CC3216-1206]  (hidden comment: 22uF 25V)
C31  4.7uF  [CC1608-0603]
C32  value 22uF  Voltage: 25V  [CC3216-1206]  (hidden comment: 22uF 25V)
C33  1uF  [CC1608-0603]
C34  Voltage: 6.3V  [CC2012-0805]  (hidden comment: 22uF)
C35  Voltage: 6.3V  [CC2012-0805]  (hidden comment: 22uF)
C36  Voltage: 6.3V  [CC2012-0805]  (hidden comment: 22uF)
C37  Voltage: 6.3V  [CC2012-0805]  (hidden comment: 22uF)
C38  100nF  [CC1608-0603]
C39  Voltage: 6.3V  [D]  (hidden comment: 220uF)
C40  Voltage: 6.3V  [D]  (hidden comment: 220uF)
IC4  TPS53126PW  [SOP65P640X120-24N]
L5  value 1.5uH  [IHLP2525]  (hidden comment: IHLP2525CZER1R5M01)
L6  value 1.5uH  [IHLP2525]  (hidden comment: IHLP2525CZER1R5M01)
R35  10K  [0603]
R36  54K9  [0603]
R37  4K7  [0603]
R38  33K  [0603]
R39  0R  [0603]
R40  10K  [0603]
R41  o.c.  [0603]
R42  4K7  [0603]
T1  IRF9910Pbf  [SOIC127P600X175-8N]  (parts A,B of 2)
T2  IRF9910Pbf  [SOIC127P600X175-8N]  (parts A,B of 2)

### Nets
+2V5: IC4.10(EN2)
+3V3: C34.2 C35.1 C36.1 C37.1 C39.1 C40.1 IC4.9(VO2) L6.2 R38.1
+5V: C21.1 C22.1 C23.1 C24.1 C26.1 C27.1 IC4.4(VO1) L5.2 R36.2
+12VCC_IN: C18.1 C19.1 C20.1 C28.2 C29.1 C30.1 C32.1 IC4.3(EN1) IC4.20(VIN) T1.5(D) T1.6(D) T2.5(D) T2.6(D)
GND: C18.2 C19.2 C20.2 C21.2 C22.2 C23.2 C24.2 C26.2 C27.2 C28.1 C29.2 C30.2 C31.2 C32.2 C33.1 C34.1 C35.2 C36.2 C37.2 C39.2 C40.2 IC4.6(GND) IC4.7(TEST1) IC4.15(PGND2) IC4.22(PGND1) R35.2 R37.2 R40.1 R41.2 R42.2 T1.1(S) T2.1(S)
NetC25_1: C25.1 IC4.24(SW1) L5.1 T1.3(S) T1.7(D) T1.8(D)
NetC25_2: C25.2 IC4.2(VBST1)
NetC31_1: C31.1 IC4.19(VREG5)
NetC33_2: C33.2 IC4.18(V5FILT) R39.1
NetC38_1: C38.1 IC4.13(SW2) L6.1 T2.3(S) T2.7(D) T2.8(D)
NetC38_2: C38.2 IC4.11(VBST2)
NetIC4_1: IC4.1(DRVH1) T1.4(G)
NetIC4_5: IC4.5(VFB1) R35.1 R36.1
NetIC4_8: IC4.8(VFB2) R38.2 R40.2
NetIC4_12: IC4.12(DRVH2) T2.4(G)
NetIC4_14: IC4.14(DRVL2) T2.2(G)
NetIC4_16: IC4.16(TRIP2) R42.1
NetIC4_17: IC4.17(TEST2) R39.2 R41.1
NetIC4_21: IC4.21(TRIP1) R37.1
NetIC4_23: IC4.23(DRVL1) T1.2(G)

### Notes on the sheet
- Copyright CERN 2011.
  This documentation describes Open Hardware and is licensed under the CERN OHL v. 1.1. You may redistribute and modify this documentation under the terms of the CERN OHL v.1.1. (http://ohwr.org/CERNOHL). This documentation is distributed WITHOUT ANY EXPRESS OR IMPLIED WARRANTY, INCLUDING OF MERCHANTABILITY, SATISFACTORY QUALITY AND FITNESS FOR A PARTICULAR PURPOSE. Please see the CERN OHL v.1.1 for applicable conditions.

### Library data of the parts
C18-C20 C29 C30 C32 = CC1206_22UF_25V_10%_X5R: Capacitor; Manufacturer1: Murata; Manufacturer1 PN: GRM31CR61E226KE15L; TC: X5R; Tolerance: ±10%; Published: 8-Jun-2000; LatestRevisionDate: 17-Jul-2002; LatestRevisionNote: Re-released for DXP Platform.; PackageReference: RAD-0.3; Publisher: Altium Limited; Distributor1: Digikey; Distributor1 PN: 490-5527-1-ND; Case: 1206
C21 C23 C24 = CC0805_22UF_16V_10%_X5R: Capacitor; Manufacturer1: TDK; Manufacturer1 PN: C2012X5R1A226K/1.25; TC: X5R; Tolerance: ±10%; Published: 8-Jun-2000; LatestRevisionDate: 17-Jul-2002; LatestRevisionNote: Re-released for DXP Platform.; PackageReference: RAD-0.3; Publisher: Altium Limited; Distributor1: Digikey; Distributor1 PN: 445-7664-1-ND; Case: 0805
C22 = CC0805_22UF_16V_10%_X5R: Capacitor; Manufacturer1: Phycomp; Manufacturer1 PN: C2012X5R1A226K/1.25; TC: X5R; Tolerance: ±10%; Published: 8-Jun-2000; LatestRevisionDate: 17-Jul-2002; LatestRevisionNote: Re-released for DXP Platform.; PackageReference: RAD-0.3; Publisher: Altium Limited; Distributor1: Digikey; Distributor1 PN: 445-7664-1-ND; Case: 0805
C25 C38 = CC0603_100NF_16V_10%_X7R: as C1 on sheet I2C_Multiplexers; Published: 8-Jun-2000; LatestRevisionDate: 17-Jul-2002; LatestRevisionNote: Re-released for DXP Platform.; PackageReference: RAD-0.3; Publisher: Altium Limited; Distributor1: Digikey; Distributor1 PN: 478-1239-1-ND; Case: 0603; Value: 100nF
C26 C27 = CP2917_220UF_10V_20%_TANT: Polarized Capacitor Tantalum; Manufacturer1: Kemet; Manufacturer1 PN: T520D227M010ATE018; Tolerance: ±20%; ESR: 18mOhm; Published: 8-Jun-2000; LatestRevisionDate: 17-Jul-2002; LatestRevisionNote: Re-released for DXP Platform.; PackageReference: RB7.6-15; Publisher: Altium Limited; Case: 2917; Distributor1: Digikey; Distributor1 PN: 399-4045-1-ND; TC: Tantalum
C28 C33 = CC0603_1UF_25V_10%_X5R: Capacitor; Manufacturer1: Phycomp; Manufacturer1 PN: GRM188R61E105KA12D; TC: X5R; Tolerance: ±10%; Voltage: 25V; Published: 8-Jun-2000; LatestRevisionDate: 17-Jul-2002; LatestRevisionNote: Re-released for DXP Platform.; Publisher: Altium Limited; Distributor1: Digikey; Distributor1 PN: 490-3897-1-ND; Case: 0603; Value: 1uF
C31 = CC0603_4.7UF_10V_10%_X5R: Capacitor; Manufacturer1: TDK; Manufacturer1 PN: C1608X5R1A475K; TC: X5R; Tolerance: ±10%; Voltage: 10V; Published: 8-Jun-2000; LatestRevisionDate: 17-Jul-2002; LatestRevisionNote: Re-released for DXP Platform.; PackageReference: RAD-0.3; Publisher: Altium Limited; Distributor1: Digikey; Distributor1 PN: 445-5170-1-ND; Case: 0603; Value: 4.7uF
C34-C37 = CC0805_22UF_6.3V_20%_X5R: Capacitor; Manufacturer1: TDK; Manufacturer1 PN: C2012X5R0J226M; TC: X5R; Tolerance: ±20%; Published: 8-Jun-2000; LatestRevisionDate: 17-Jul-2002; LatestRevisionNote: Re-released for DXP Platform.; PackageReference: RAD-0.3; Publisher: Altium Limited; Distributor1: Digikey; Distributor1 PN: 445-1422-1-ND; Case: 0805; Value: 22uF
C39 C40 = CP2917_220UF_6.3V_20%_TANT: Polarized Capacitor Tantalum; Manufacturer1: Kemet; Manufacturer1 PN: T520D227M006ATE009; Tolerance: ±20%; ESR: 9mOhm; Published: 8-Jun-2000; LatestRevisionDate: 17-Jul-2002; LatestRevisionNote: Re-released for DXP Platform.; PackageReference: RB7.6-15; Publisher: Altium Limited; Case: 2917; Distributor1: Digikey; Distributor1 PN: T520D227M006ATE009; TC: Tantalum; Value: 220uF
IC4 = TPS53126PW: Dual Synchronous Step-Down Controller For Low Voltage Power Rails; Manufacturer 1: TEXAS INSTRUMENTS; Table: Analog & Interface; Part Number: TPS53126PW; Component Kind: Standard; Component Type: Standard; Device: TPS53126PW; PackageDescription: SOP, 0.65mm Pitch; 24 Pin, 4.40mm W X 7.80mm L X 1.20mm H Body, IPC Medium Density; Part Description: Dual Synchronous Step-Down Controller For Low Voltage Power Rails; Manufacturer PN: TPS53126PW; Pin Count: 24; Case: QFN24; Mounted: Yes; Socket: No; SMD: Yes; ComponentHeight: 1.0mm; Author: CERN DEM JLC; HelpURL: \\cern.ch\dfs\Applications\Altium\Datasheets\TPS53126RGET.pdf; CreateDate: 2010-08-26; LatestRevisionDate: 2010-08-26; Distributor1: Digikey; Distributor1 PN: 296-24555-1-ND
L5 L6 = Inductor: Low Profile, High Current Inductor; Manufacturer: Vishay/Dale; Published: 8-Jun-2000; Revision: July-2002: Re-released for DXP Platform.; Publisher: Altium Limited; Manufacturer PN: IHLP2525CZER1R5M01; Distributor1 PN: 541-1007-1-ND; Distributor1: Digikey
R35 R40 = R0603_10K_±1%_0.2W_100PPM: SMD Resistor; Manufacturer1: Rohm; Manufacturer1 PN: ESR03EZPF1002; TCR: 100ppm; Power Rating: 0.2W; Tolerance: ±1%; Case: 0603; Distributor1: DigiKey; Distributor1 PN: RHM10KADCT-ND; Value: 10K
R36 = R0603_54K9_±1%_0.1W_100PPM: SMD Resistor; Manufacturer1: Panasonic; Manufacturer1 PN: ERJ-3EKF5492V; TCR: 100ppm; Power Rating: 0.1W; Tolerance: ±1%; Case: 0603; Distributor1: DigiKey; Distributor1 PN: P54.9KHCT-ND; Value: 54K9
R37 R42 = R0603_4.7K_±1%_0.1W_100PPM: as R8 on sheet Main; Case: 0603; Distributor1: DigiKey; Distributor1 PN: P4.70KHCT-ND; Value: 4K7
R38 = R0603_33K_±1%_0.1W_100PPM: SMD Resistor; Manufacturer1: Panasonic; Manufacturer1 PN: ERJ-3EKF3302V; TCR: 100ppm; Power Rating: 0.1W; Tolerance: ±1%; Case: 0603; Distributor1: DigiKey; Distributor1 PN: P33.0KHCT-ND; Value: 33K
R39 = R0603_0R_0.1W_JUMPER: SMD Resistor; Manufacturer1: Yageo; Manufacturer1 PN: RC0603JR-070RL; TCR: 200ppm; Power Rating: 0.1W; Case: 0603; Distributor1: DigiKey; Distributor1 PN: 311-0.0GRCT-ND; Tolerance: -; Value: 0R
R41 = R0603_O.C.: SMD Resistor; Manufacturer1: NA; Case: 0603; Manufacturer1 PN: NA; Distributor1: NA; Distributor1 PN: NA; TCR: NA; Power Rating: NA; Tolerance: NA; Value: o.c.
T1 T2 = IRF9910Pbf: Dual SO-8 MOSFET For POL Cconverter; Part Description: 20V 10A(Q1) 20V 12A (Q2) Dual SO-8 MOSFET For POL Cconverter; Manufacturer: INTERNATIONAL RECTIFIER; Table: Transistors; Part Number: IRF9910Pbf; Component Kind: Standard; Component Type: Standard; Device: IRF9910Pbf; PackageDescription: SOIC 8, Pitch 1.27mm - Body 4x5mm, IPC Medium Density; Manufacturer Part Number: IRF9910Pbf; Pin Count: 8; Case: DO8; Mounted: Yes; Socket: No; SMD: Yes; ComponentHeight: 1.75mm; HelpURL: \\cern.ch\dfs\Applications\Altium\Datasheets\IRF9910Pbf.pdf; Author: CERN DEM JLC; CreateDate: 30/08/2010; LatestRevisionDate: 30/08/2010

## Sheet TEST_USB.SchDoc
size A4
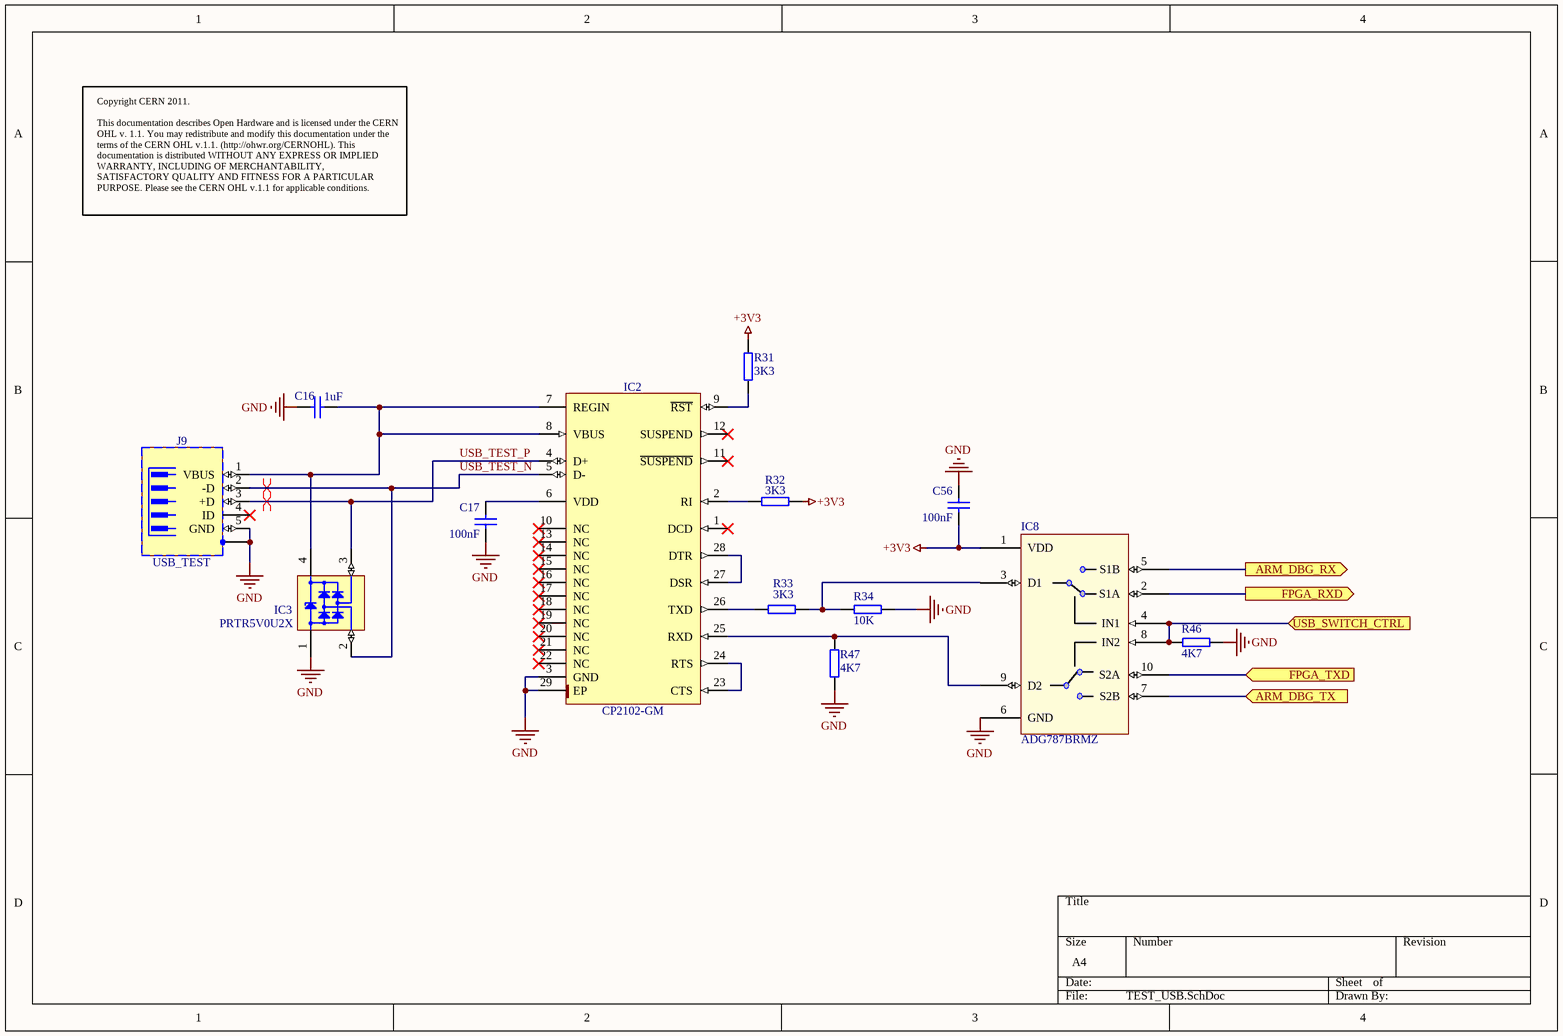
[diagram p4: TEST_USB.SchDoc]

### Parts
C16  1uF  [CC1608-0603]
C17  100nF  [CC1608-0603]
C56  100nF  [CC1608-0603]
IC2  CP2102-GM  [QFN50P500X500X100-29N-S335]
IC3  PRTR5V0U2X  [SOT190P230X110-4N]
IC8  ADG787BRMZ  [SOP50P490X109-10N]
J9  USB_TEST  [TYCO_1734035-1]
R31  3K3  [0603]
R32  3K3  [0603]
R33  3K3  [0603]
R34  10K  [0603]
R46  4K7  [0603]
R47  4K7  [0603]

### Ports
ARM_DBG_RX (out), ARM_DBG_TX (in), FPGA_RXD (out), FPGA_TXD (in), USB_SWITCH_CTRL (in)

### Nets
+3V3: C56.2 IC8.1(VDD) R31.2 R32.2
GND: C16.1 C17.2 C56.1 IC2.3(GND) IC2.29(EP) IC3.1(GND) IC8.6(GND) J9.5(GND) J9.6(SH) R34.1 R46.1 R47.2
FPGA_RXD: IC8.2(S1A) ; port FPGA_RXD
FPGA_TXD: IC8.10(S2A) ; port FPGA_TXD
USB_TEST_N: IC2.5(D-) IC3.2(I/O1) J9.2(-D)
USB_TEST_P: IC2.4(D+) IC3.3(I/O2) J9.3(+D)
NetC16_2: C16.2 IC2.7(REGIN) IC2.8(VBUS) IC3.4(VCC) J9.1(VBUS)
NetC17_1: C17.1 IC2.6(VDD)
NetIC2_2: IC2.2(RI) R32.1
NetIC2_9: IC2.9(~{RST}) R31.1
NetIC2_23: IC2.23(CTS) IC2.24(RTS)
NetIC2_25: IC2.25(RXD) IC8.9(D2) R47.1
NetIC2_26: IC2.26(TXD) R33.1
NetIC2_27: IC2.27(DSR) IC2.28(DTR)
NetIC8_3: IC8.3(D1) R33.2 R34.2
NetIC8_4: IC8.4(IN1) IC8.8(IN2) R46.2 ; port USB_SWITCH_CTRL
NetIC8_5: IC8.5(S1B) ; port ARM_DBG_RX
NetIC8_7: IC8.7(S2B) ; port ARM_DBG_TX

Not connected (* = marked no-connect by the designer): IC2 1(DCD)* 10(NC)* 11(~{SUSPEND})* 12(SUSPEND)* 13(NC)* 14(NC)* 15(NC)* 16(NC)* 17(NC)* 18(NC)* 19(NC)* 20(NC)* 21(NC)* 22(NC)*; J9 4(ID)*

### Layout directives
differential pair: USB_TEST_N, USB_TEST_P

### Notes on the sheet
- Copyright CERN 2011.
  This documentation describes Open Hardware and is licensed under the CERN OHL v. 1.1. You may redistribute and modify this documentation under the terms of the CERN OHL v.1.1. (http://ohwr.org/CERNOHL). This documentation is distributed WITHOUT ANY EXPRESS OR IMPLIED WARRANTY, INCLUDING OF MERCHANTABILITY, SATISFACTORY QUALITY AND FITNESS FOR A PARTICULAR PURPOSE. Please see the CERN OHL v.1.1 for applicable conditions.

### Library data of the parts
C16 = CC0603_1UF_25V_10%_X5R: as C28 on sheet Power_Supply; Published: 8-Jun-2000; LatestRevisionDate: 17-Jul-2002; LatestRevisionNote: Re-released for DXP Platform.; Publisher: Altium Limited; Distributor1: Digikey; Distributor1 PN: 490-3897-1-ND; Case: 0603; Value: 1uF
C17 C56 = CC0603_100NF_16V_10%_X7R: as C1 on sheet I2C_Multiplexers; Published: 8-Jun-2000; LatestRevisionDate: 17-Jul-2002; LatestRevisionNote: Re-released for DXP Platform.; PackageReference: RAD-0.3; Publisher: Altium Limited; Distributor1: Digikey; Distributor1 PN: 478-1239-1-ND; Case: 0603; Value: 100nF
IC2 = CP2102-GM: Single-Chip USB to UART Bridge; Manufacturer: SILICON LABS; Table: Analog & Interface; Part Number: CP2102-GM; Component Kind: Standard; Component Type: Standard; Device: CP2102-GM; PackageDescription: QFN, 0.50mm Pitch, Square; 28 pin, 5.00mm L X 5.00mm W X 1.00mm H body (w/thermal tab 3.35 X 3.35mm),  IPC Medium Density; Part Description: Single-Chip USB to UART Bridge; Manufacturer Part Number: CP2102-GM; Pin Count: 29; Case: QFN28; Mounted: Yes; Socket: No; SMD: Yes; ComponentHeight: 1.0mm; Author: CERN DEM JLC; HelpURL: \\cern.ch\dfs\Applications\Altium\Datasheets\CP2102-GM.pdf; CreateDate: 3/3/2011; LatestRevisionDate: 3/3/2011
IC3 = PRTR5V0U2X: Ultra Low Capacitance Double Rail-to-Rail ESD Protection Diode; Part Description: Ultra Low Capacitance (1pF) Double Rail-to-Rail ESD Protection Diode (8kV); Manufacturer: PHILIPS NXP; Voltage: 5.5V; Table: Diodes; Part Number: PRTR5V0U2X; Component Kind: Standard; Component Type: Standard; Device: PRTR5V0U2X; PackageDescription: SOT143B, SOT, 1.90mm Pitch; 4 Pin, 1.30mm W X 2.90mm L X 1.10mm H body, IPC Medium Density; Manufacturer Part Number: PRTR5V0U2X; Pin Count: 4; Case: SOT143B; Mounted: Yes; Socket: No; SMD: Yes; ComponentHeight: 1.1mm; HelpURL: \\cern.ch\dfs\Applications\Altium\Datasheets\PRTR5V0U2X.pdf; Author: CERN DEM JLC; CreateDate: 3/22/2011; LatestRevisionDate: 3/22/2011
IC8 = ADG787BRMZ: Dual 2:1 MUX/DEMUX USB1.1 Switch; Manufacturer1: Analog Devices; Manufacturer1_PN: ADG787BRMZ; Distributor1: Digikey; Distributor1_PN: ADG787BRMZ-ND
J9 = TYCO_1734035-1: 5 Pin + 1 Shield Mini USB Type B Receptacle; Part Description: 5 Position, Right Angle, SMD Mini USB Type B Receptacle; Manufacturer: TYCO ELECTRONICS; Table: TYCO; Part Number: TYCO_1734035-1; Component Kind: Standard; Component Type: Standard; Pin Count: 6; Family: USB; Mounted: Yes; Socket: No; SMD: Yes; Status: None; Manufacturer Part Number: 1734035-1; ComponentHeight: 3.95mm; HelpURL: \\cern.ch\dfs\Applications\Altium\Datasheets\TYCO_1734035-1.pdf; Author: CERN DEM JLC; CreateDate: 02/05/2011; LatestRevisionDate: 02/05/2011
R31-R33 = R0603_3K3_±1%_0.1W_100PPM: SMD Resistor; Manufacturer1: Yageo; Manufacturer1 PN: RC0603FR-073K3L; TCR: 100ppm; Power Rating: 0.1W; Tolerance: ±1%; Case: 0603; Distributor1: DigiKey; Distributor1 PN: 311-3.30KHRCT-ND; Value: 3K3
R34 = R0603_10K_±1%_0.2W_100PPM: as R35 on sheet Power_Supply; Case: 0603; Distributor1: DigiKey; Distributor1 PN: RHM10KADCT-ND; Value: 10K
R46 R47 = R0603_4.7K_±1%_0.1W_100PPM: as R8 on sheet Main; Case: 0603; Distributor1: DigiKey; Distributor1 PN: P4.70KHCT-ND; Value: 4K7

## Sheet Connectors_GPIOs.SchDoc
size A3
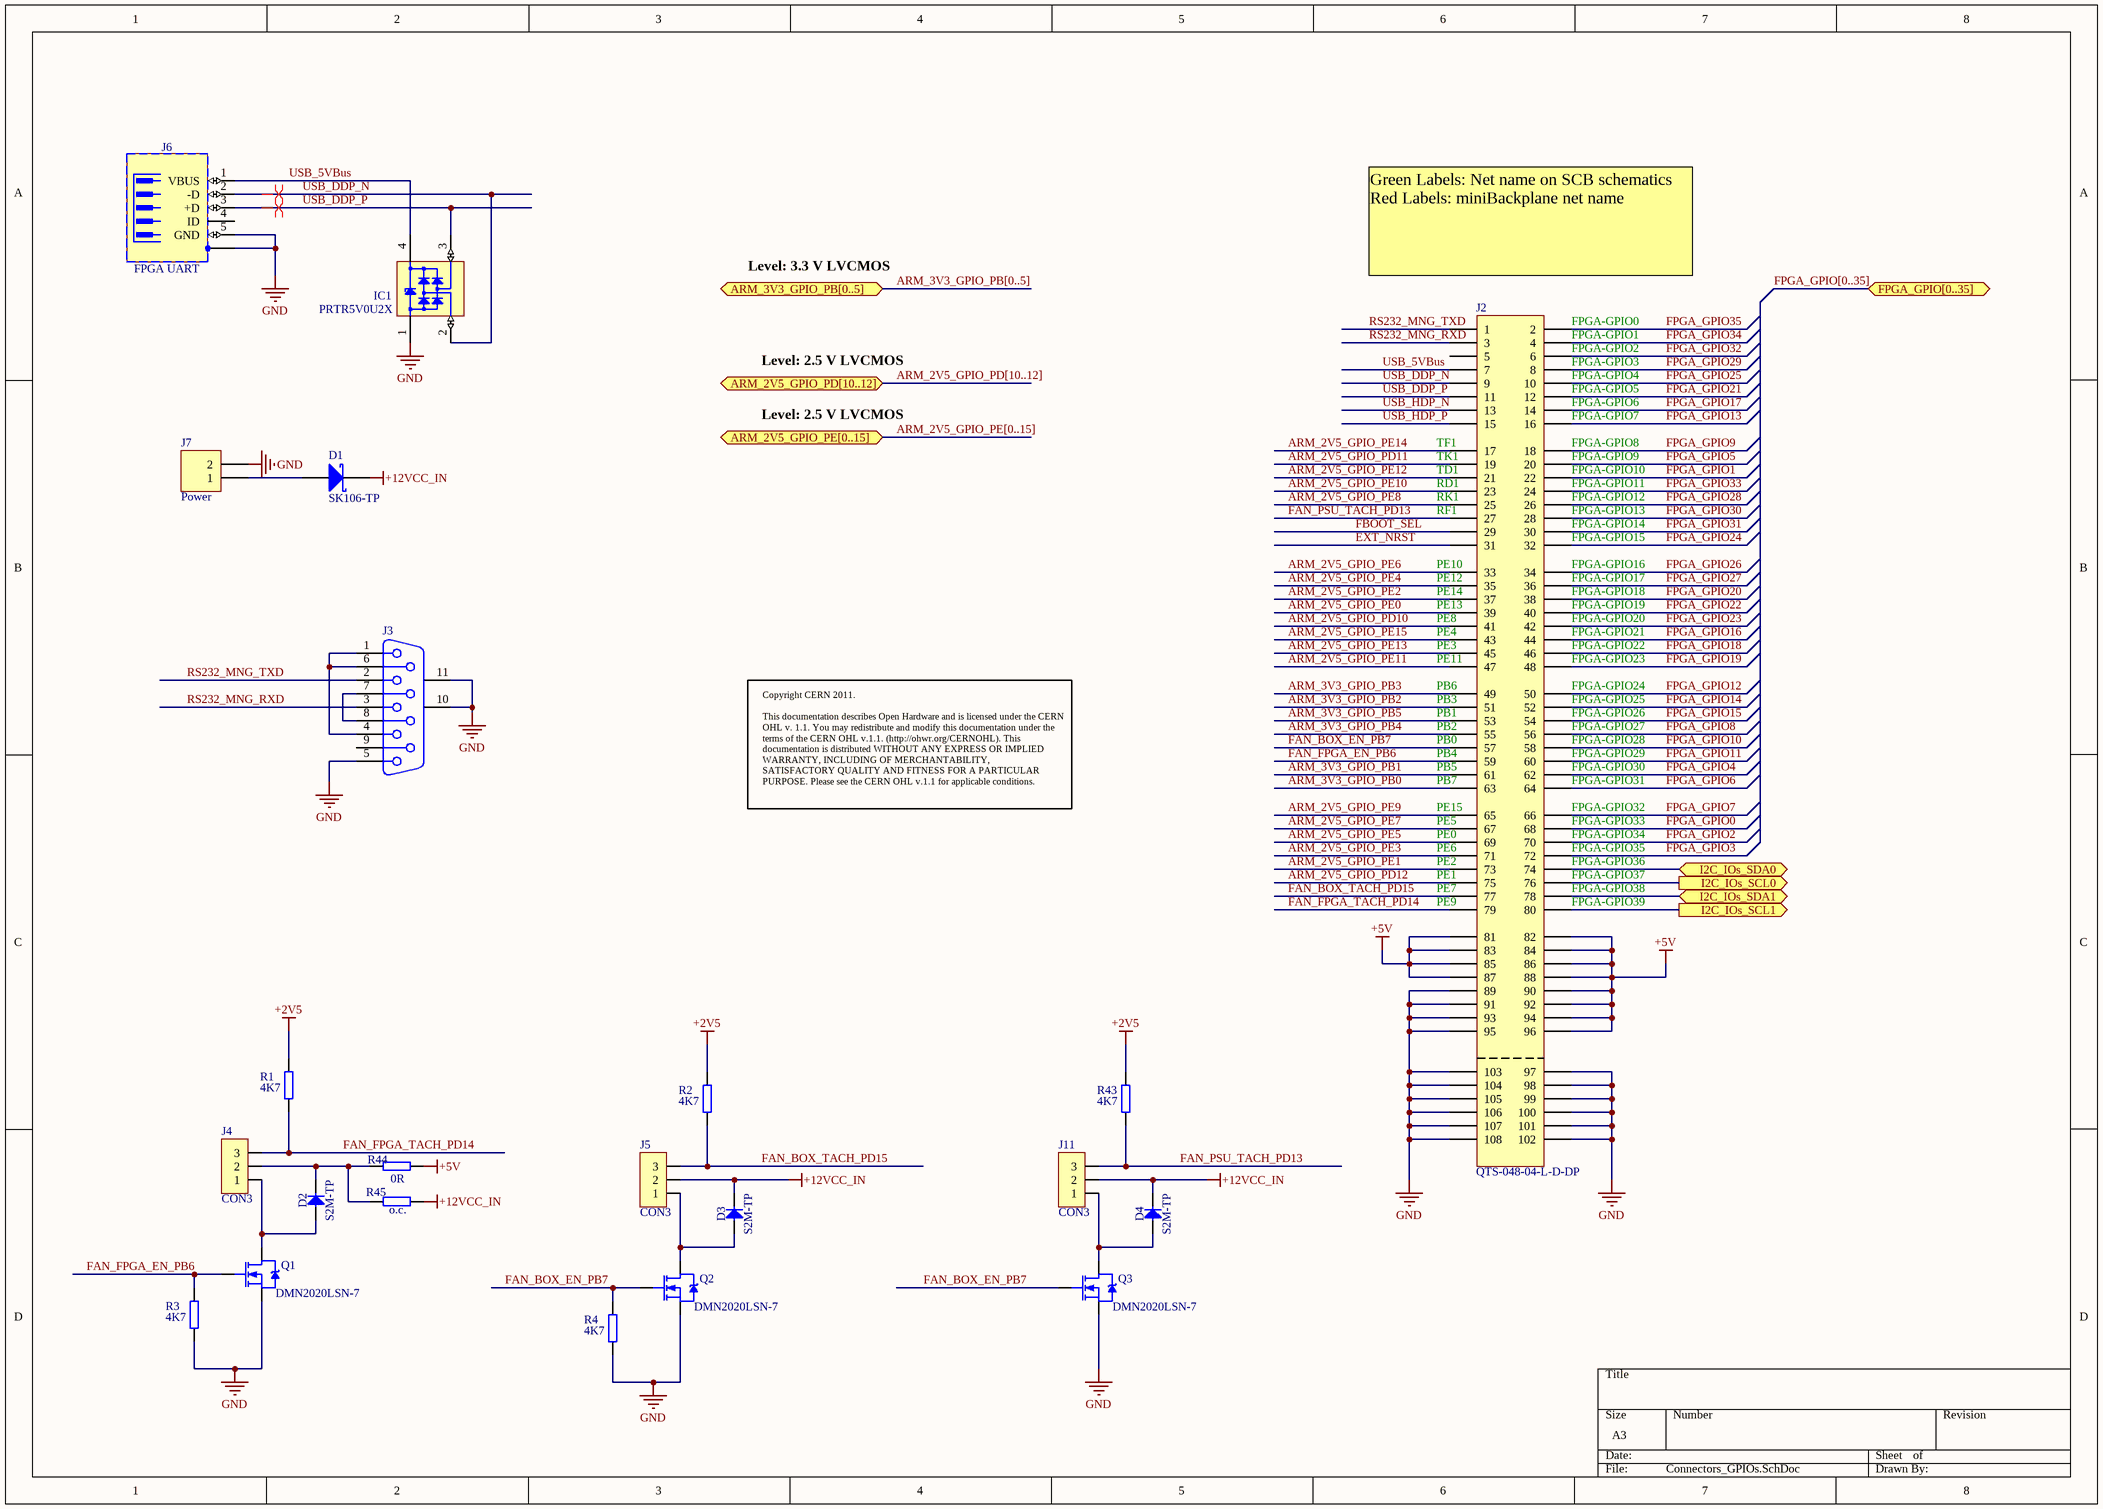
[diagram p5: Connectors_GPIOs.SchDoc]

### Parts
D1  SK106-TP  [DO-214AB/SMB-MCC]
D2  S2M-TP  [DO-214AA/SMB-MCC]
D3  S2M-TP  [DO-214AA/SMB-MCC]
D4  S2M-TP  [DO-214AA/SMB-MCC]
IC1  PRTR5V0U2X  [SOT190P230X110-4N]
J2  QTS-048-04-L-D-DP  [QTS-048-XX-X-D-DP-A]
J3  D Connector 9  [DSUB1.385-2H9]  (value not drawn)
J4  CON3  [MOLEX_22-11-2032]
J5  CON3  [MOLEX_22-11-2032]
J6  FPGA UART  [TYCO_1734035-1]
J7  Power  [TYCO_794120_1]
J11  CON3  [MOLEX_22-11-2032]
Q1  DMN2020LSN-7  [SC-59-3]
Q2  DMN2020LSN-7  [SC-59-3]
Q3  DMN2020LSN-7  [SC-59-3]
R1  4K7  [0603]
R2  4K7  [0603]
R3  4K7  [0603]
R4  4K7  [0603]
R43  4K7  [0603]
R44  0R  [0603]
R45  o.c.  [0603]

### Ports
ARM_2V5_GPIO_PD[10..12] (bidir), ARM_2V5_GPIO_PE[0..15] (bidir), ARM_3V3_GPIO_PB[0..5] (bidir), FPGA_GPIO[0..35] (bidir), I2C_IOs_SCL0 (out), I2C_IOs_SCL1 (out), I2C_IOs_SDA0 (bidir), I2C_IOs_SDA1 (bidir)

### Nets
+2V5: R1.1 R2.1 R43.1
+5V: J2.81 J2.82 J2.83 J2.84 J2.85 J2.86 J2.87 J2.88 J2.90 J2.92 J2.94 J2.96 R44.2
+12VCC_IN: D1.1(K) D3.1(C) D4.1(C) J5.2 J11.2 R45.1
GND: IC1.1(GND) J2.89 J2.91 J2.93 J2.95 J2.97 J2.98 J2.99 J2.100 J2.101 J2.102 J2.103 J2.104 J2.105 J2.106 J2.107 J2.108 J3.5 J3.10(MH1) J3.11(MH2) J6.5(GND) J6.6(SH) J7.2 Q1.3(S) Q2.3(S) Q3.3(S) R3.2 R4.2
ARM_2V5_GPIO_PD10: J2.41  [also labelled PE8]
ARM_2V5_GPIO_PD11: J2.19  [also labelled TK1]
ARM_2V5_GPIO_PD12: J2.75  [also labelled PE1]
ARM_2V5_GPIO_PE0: J2.39  [also labelled PE13]
ARM_2V5_GPIO_PE1: J2.73  [also labelled PE2]
ARM_2V5_GPIO_PE2: J2.37  [also labelled PE14]
ARM_2V5_GPIO_PE3: J2.71  [also labelled PE6]
ARM_2V5_GPIO_PE4: J2.35  [also labelled PE12]
ARM_2V5_GPIO_PE5: J2.69  [also labelled PE0]
ARM_2V5_GPIO_PE6: J2.33  [also labelled PE10]
ARM_2V5_GPIO_PE7: J2.67  [also labelled PE5]
ARM_2V5_GPIO_PE8: J2.25  [also labelled RK1]
ARM_2V5_GPIO_PE9: J2.65  [also labelled PE15]
ARM_2V5_GPIO_PE10: J2.23  [also labelled RD1]
ARM_2V5_GPIO_PE11: J2.47  [also labelled PE11]
ARM_2V5_GPIO_PE12: J2.21  [also labelled TD1]
ARM_2V5_GPIO_PE13: J2.45  [also labelled PE3]
ARM_2V5_GPIO_PE14: J2.17  [also labelled TF1]
ARM_2V5_GPIO_PE15: J2.43  [also labelled PE4]
ARM_3V3_GPIO_PB0: J2.63  [also labelled PB7]
ARM_3V3_GPIO_PB1: J2.61  [also labelled PB5]
ARM_3V3_GPIO_PB2: J2.51  [also labelled PB3]
ARM_3V3_GPIO_PB3: J2.49  [also labelled PB6]
ARM_3V3_GPIO_PB4: J2.55  [also labelled PB2]
ARM_3V3_GPIO_PB5: J2.53  [also labelled PB1]
EXT_NRST: J2.31
FAN_BOX_EN_PB7: J2.57 Q2.1(G) Q3.1(G) R4.1  [also labelled PB0]
FAN_BOX_TACH_PD15: J2.77 J5.3 R2.2  [also labelled PE7]
FAN_FPGA_EN_PB6: J2.59 Q1.1(G) R3.1  [also labelled PB4]
FAN_FPGA_TACH_PD14: J2.79 J4.3 R1.2  [also labelled PE9]
FAN_PSU_TACH_PD13: J2.27 J11.3 R43.2  [also labelled RF1]
FBOOT_SEL: J2.29
FPGA-GPIO0: J2.2  [also labelled FPGA_GPIO35]
FPGA-GPIO1: J2.4  [also labelled FPGA_GPIO34]
FPGA-GPIO2: J2.6  [also labelled FPGA_GPIO32]
FPGA-GPIO3: J2.8  [also labelled FPGA_GPIO29]
FPGA-GPIO4: J2.10  [also labelled FPGA_GPIO25]
FPGA-GPIO5: J2.12  [also labelled FPGA_GPIO21]
FPGA-GPIO6: J2.14  [also labelled FPGA_GPIO17]
FPGA-GPIO7: J2.16  [also labelled FPGA_GPIO13]
FPGA-GPIO8: J2.18  [also labelled FPGA_GPIO9]
FPGA-GPIO9: J2.20  [also labelled FPGA_GPIO5]
FPGA-GPIO10: J2.22  [also labelled FPGA_GPIO1]
FPGA-GPIO11: J2.24  [also labelled FPGA_GPIO33]
FPGA-GPIO12: J2.26  [also labelled FPGA_GPIO28]
FPGA-GPIO13: J2.28  [also labelled FPGA_GPIO30]
FPGA-GPIO14: J2.30  [also labelled FPGA_GPIO31]
FPGA-GPIO15: J2.32  [also labelled FPGA_GPIO24]
FPGA-GPIO16: J2.34  [also labelled FPGA_GPIO26]
FPGA-GPIO17: J2.36  [also labelled FPGA_GPIO27]
FPGA-GPIO18: J2.38  [also labelled FPGA_GPIO20]
FPGA-GPIO19: J2.40  [also labelled FPGA_GPIO22]
FPGA-GPIO20: J2.42  [also labelled FPGA_GPIO23]
FPGA-GPIO21: J2.44  [also labelled FPGA_GPIO16]
FPGA-GPIO22: J2.46  [also labelled FPGA_GPIO18]
FPGA-GPIO23: J2.48  [also labelled FPGA_GPIO19]
FPGA-GPIO24: J2.50  [also labelled FPGA_GPIO12]
FPGA-GPIO25: J2.52  [also labelled FPGA_GPIO14]
FPGA-GPIO26: J2.54  [also labelled FPGA_GPIO15]
FPGA-GPIO27: J2.56  [also labelled FPGA_GPIO8]
FPGA-GPIO28: J2.58  [also labelled FPGA_GPIO10]
FPGA-GPIO29: J2.60  [also labelled FPGA_GPIO11]
FPGA-GPIO30: J2.62  [also labelled FPGA_GPIO4]
FPGA-GPIO31: J2.64  [also labelled FPGA_GPIO6]
FPGA-GPIO32: J2.66  [also labelled FPGA_GPIO7]
FPGA-GPIO33: J2.68  [also labelled FPGA_GPIO0]
FPGA-GPIO34: J2.70  [also labelled FPGA_GPIO2]
FPGA-GPIO35: J2.72  [also labelled FPGA_GPIO3]
FPGA-GPIO36: J2.74 ; port I2C_IOs_SDA0
FPGA-GPIO37: J2.76 ; port I2C_IOs_SCL0
FPGA-GPIO38: J2.78 ; port I2C_IOs_SDA1
FPGA-GPIO39: J2.80 ; port I2C_IOs_SCL1
RS232_MNG_RXD: J2.3 J3.3
RS232_MNG_TXD: J2.1 J3.2
USB_5VBus: IC1.4(VCC) J2.7 J6.1(VBUS)
USB_DDP_N: IC1.2(I/O1) J2.9 J6.2(-D)
USB_DDP_P: IC1.3(I/O2) J2.11 J6.3(+D)
USB_HDP_N: J2.13
USB_HDP_P: J2.15
NetD1_2: D1.2(A) J7.1
NetD2_1: D2.1(C) J4.2 R44.1 R45.2
NetD2_2: D2.2(A) J4.1 Q1.2(D)
NetD3_2: D3.2(A) J5.1 Q2.2(D)
NetD4_2: D4.2(A) J11.1 Q3.2(D)
NetJ3_1: J3.1 J3.4 J3.6
NetJ3_7: J3.7 J3.8

Not connected (* = marked no-connect by the designer): J2 5; J3 9; J6 4(ID)

### Buses and harness runs
bus ARM_2V5_GPIO_PD[10..12] = port ARM_2V5_GPIO_PD[10..12]
bus ARM_2V5_GPIO_PE[0..15] = port ARM_2V5_GPIO_PE[0..15]
bus ARM_3V3_GPIO_PB[0..5] = port ARM_3V3_GPIO_PB[0..5]
bus FPGA_GPIO[0..35] = port FPGA_GPIO[0..35]

### Layout directives
differential pair: USB_DDP_N, USB_DDP_P

### Notes on the sheet
- Level: 3.3 V LVCMOS
- Green Labels: Net name on SCB schematics
  Red Labels: miniBackplane net name
- Level: 2.5 V LVCMOS
- Copyright CERN 2011.
  This documentation describes Open Hardware and is licensed under the CERN OHL v. 1.1. You may redistribute and modify this documentation under the terms of the CERN OHL v.1.1. (http://ohwr.org/CERNOHL). This documentation is distributed WITHOUT ANY EXPRESS OR IMPLIED WARRANTY, INCLUDING OF MERCHANTABILITY, SATISFACTORY QUALITY AND FITNESS FOR A PARTICULAR PURPOSE. Please see the CERN OHL v.1.1 for applicable conditions.

### Library data of the parts
D1 = SK106-TP: Schottky Diode 10A 60V; Manufacturer1: Micro Commercial Components; Distributor1 PN: SK106-TPCT-ND; Manufacturer1 PN: SK106-TP; Distributor1: Digikey
D2-D4 = S2M-TP: 2 A Silicon Rectifier 50 to 1000 Volts; Manufacturer1: Micro Commercial Components; Author: CERN DEM JLC; Manufacturer1 PN: S2M-TP; Distributor1: Digikey; Distributor1 PN: S2M-TPMSCT-ND
IC1 = PRTR5V0U2X: as IC3 on sheet TEST_USB; Part Number: PRTR5V0U2X; Component Kind: Standard; Component Type: Standard; Device: PRTR5V0U2X; PackageDescription: SOT143B, SOT, 1.90mm Pitch; 4 Pin, 1.30mm W X 2.90mm L X 1.10mm H body, IPC Medium Density; Manufacturer Part Number: PRTR5V0U2X; Pin Count: 4; Case: SOT143B; Mounted: Yes; Socket: No; SMD: Yes; ComponentHeight: 1.1mm; HelpURL: \\cern.ch\dfs\Applications\Altium\Datasheets\PRTR5V0U2X.pdf; Author: CERN DEM JLC; CreateDate: 3/22/2011; LatestRevisionDate: 3/22/2011
J2 = QTS-048-01-L-D-DP: as J1 on sheet Connector_GTX; Manufacturer1 PN: QTS-048-01-L-D-DP
J3 = D Connector 9: Receptacle Assembly, 9 Position, Right Angle; Manufacturer1 PN: 1734348-1; Manufacturer1: TE Connectivity; PackageDocument: O; Positions: 9; Published: 15-Jun-2001; LatestRevisionDate: 17-Jul-2002; LatestRevisionNote: Re-released for DXP Platform.; DatasheetDocument: 1-Sep-1999; PackageReference: 788750; Publisher: Altium Limited; Orientation: Right Angle; Gender: Receptacle; Distributor1: Digikey; Distributor1 PN: A35109-ND
J4 J5 J11 = CON3: Connector; Manufacturer1: Molex; Distributor1: Digikey; Distributor1 PN: WM2701-ND; Manufacturer1 PN: 22-11-2032
J6 = TYCO_1734035-1: 5 Pin + 1 Shield USB Receptacle; Part Description: 5 Position, Right Angle, SMD Mini USB Type B Receptacle; Manufacturer: TYCO ELECTRONICS; Table: TYCO; Part Number: TYCO_1734035-1; Component Kind: Standard; Component Type: Standard; Pin Count: 6; Family: USB; Mounted: Yes; Socket: No; SMD: Yes; Status: None; Manufacturer Part Number: 1734035-1; ComponentHeight: 3.95mm; HelpURL: \\cern.ch\dfs\Applications\Altium\Datasheets\TYCO_1734035-1.pdf; Author: CERN DEM JLC; CreateDate: 02/05/2011; LatestRevisionDate: 02/05/2011
J7 = Header 2: Header, 2-Pin; Manufacturer1 PN: 794120-1; Manufacturer1: Tyco Electronics; LatestRevisionDate: 17-Jul-2002; LatestRevisionNote: Re-released for DXP Platform.; Publisher: Altium Limited; Distributor1: Digikey; Distributor1 PN: A25753-ND
Q1-Q3 = DMN2020LSN-7: N-Channel Power MOSFET; Manufacturer: Diodes Inc.; Published: 8-Jun-2000; LatestRevisionDate: 17-Jul-2002; LatestRevisionNote: Re-released for DXP Platform.; DatasheetVersion: PD-9.814; Publisher: Altium Limited; ComponentLink1Description: Manufacturer Link; ComponentLink1URL: http://www.irf.com/; Value: DMN2020LSN-7; Distributor1: Digikey; Distributor1 PN: DMN2020LSN-7DICT-ND
R1-R4 R43 = R0603_4.7K_±1%_0.1W_100PPM: as R8 on sheet Main; Case: 0603; Distributor1: DigiKey; Distributor1 PN: P4.70KHCT-ND; Value: 4K7
R44 = R0603_0R_0.1W_JUMPER: as R39 on sheet Power_Supply; Case: 0603; Distributor1: DigiKey; Distributor1 PN: 311-0.0GRCT-ND; Tolerance: -; Value: 0R
R45 = R0603_O.C.: SMD Resistor; Manufacturer1: NA; Case: 0603; Manufacturer1 PN: NA; Distributor1: NA; Distributor1 PN: NA; TCR: NA; Power Rating: NA; Tolerance: NA; Value: o.c.